# EAGLE design LSR_CNTRL (EAGLE 7.7.0)

## Sheet 1 of 3
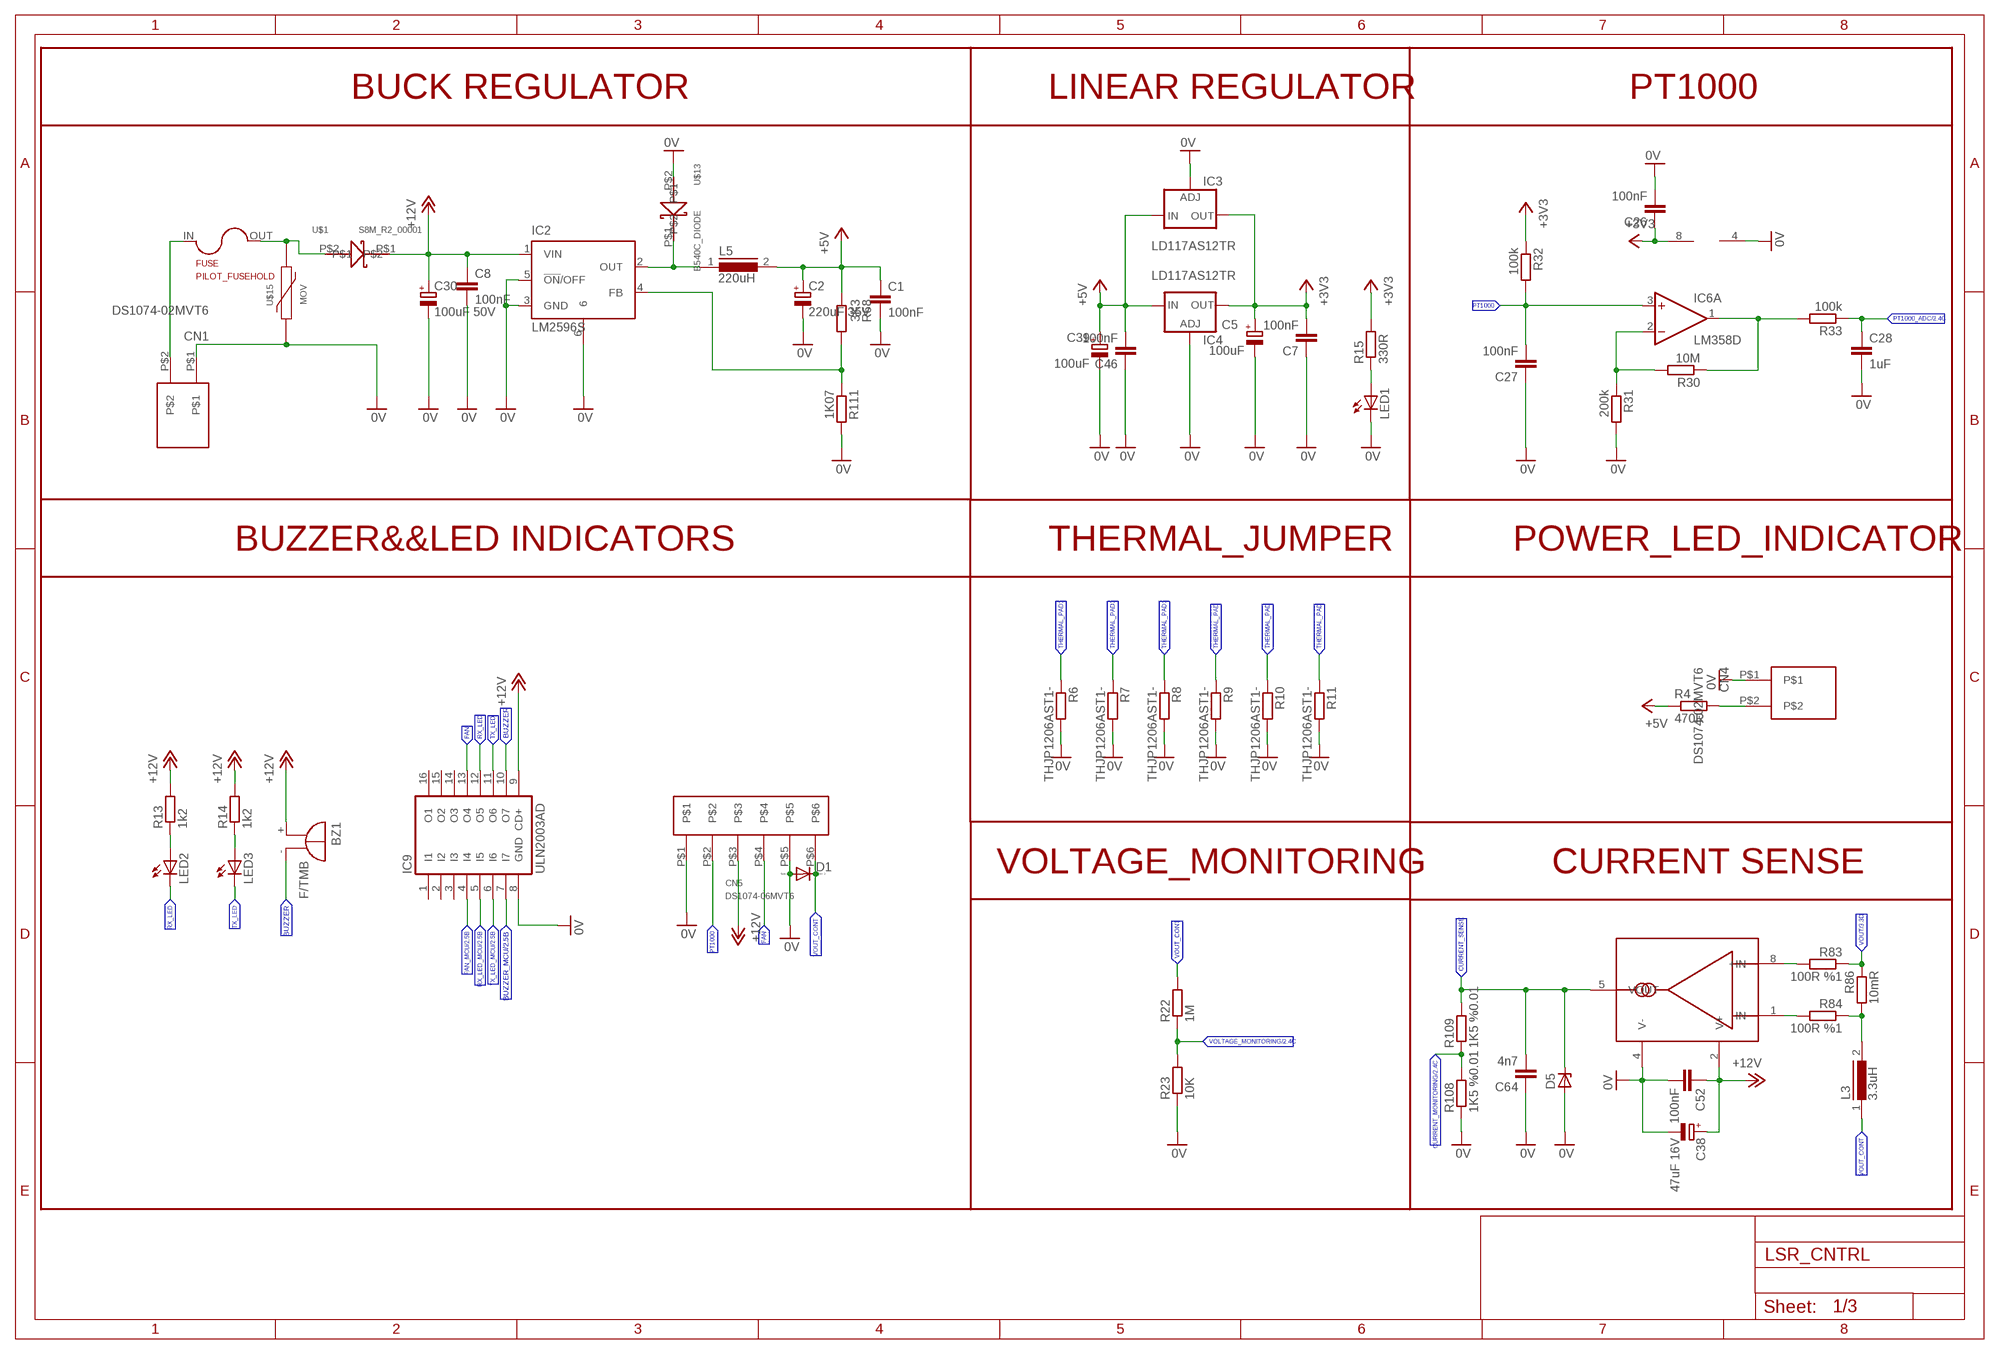
[diagram p0: schematic, sheet 1]

### Parts
BZ1  F/TMB  [F/TMB]
C1  100nF  C-EUC0805  [C0805]
C2  220uF 35V  CPOL-EU153CLV-0810  [153CLV-0810]
C5  100uF  CPOL-EU153CLV-0605  [153CLV-0605]
C7  100nF  C-EUC0603  [C0603]
C8  100nF  C-EUC0805  [C0805]
C26  100nF  C-EUC0603  [C0603]
C27  100nF  C-EUC0603  [C0603]
C28  1uF  C-EUC1206  [C1206]
C30  100uF 50V  CPOL-EU153CLV-0810  [153CLV-0810]
C38  47uF 16V  CPOL-EUB/3528-21R  [B/3528-21R]
C39  100uF  CPOL-EU153CLV-0605  [153CLV-0605]
C46  100nF  C-EUC0603  [C0603]
C52  100nF  C-EUC0805  [C0805]
C64  4n7  C-EUC0805  [C0805]
CN1  DS1074-02MVT6  [DS1074-02MVT6]
CN4  DS1074-02MVT6  [DS1074-02MVT6]
CN5  DS1074-06MVT6  [DS1074-06MVT6]
D1  DIODE-SMB  [SMB]
D5  ZENER-DIODESOD80C  [SOD80C]
FUSE  PILOT_FUSEHOLD  RTM_FUSEHOLD  [RTM_FUSEHOLD]
IC2  LM2596S  [TO263-5]
IC3  LD117AS12TR  [SOT223]
IC4  LD117AS12TR  [SOT223]
IC6  LM358D  [SO08]
IC9  ULN2003AD  [SO16]
L3  3.3uH  DR127  [DR127]
L5  220uH  DR125  [DR125]
LED1  LEDCHIPLED_0805  [CHIPLED_0805]
LED2  LEDCHIPLED_0805  [CHIPLED_0805]
LED3  LEDCHIPLED_0805  [CHIPLED_0805]
R4  470R  R-EU_M0805  [M0805]
R6  THJP1206AST1-  R-EU_M0805  [M0805]
R7  THJP1206AST1-  R-EU_M0805  [M0805]
R8  THJP1206AST1-  R-EU_M0805  [M0805]
R9  THJP1206AST1-  R-EU_M0805  [M0805]
R10  THJP1206AST1-  R-EU_M0805  [M0805]
R11  THJP1206AST1-  R-EU_M0805  [M0805]
R13  1k2  R-EU_R0603  [R0603]
R14  1k2  R-EU_R0603  [R0603]
R15  330R  R-EU_R0603  [R0603]
R22  1M  R-EU_R0603  [R0603]
R23  10K  R-EU_R0603  [R0603]
R30  10M  R-EU_R0603  [R0603]
R31  200k  R-EU_R0603  [R0603]
R32  100k  R-EU_R0603  [R0603]
R33  100k  R-EU_R0603  [R0603]
R68  3K3  R-EU_M0805  [M0805]
R83  100R %1  R-EU_R0805  [R0805]
R84  100R %1  R-EU_R0805  [R0805]
R86  10mR  R-EU_R2512  [R2512]
R108  1K5 %0.01  R-EU_R0603  [R0603]
R109  1K5 %0.01  R-EU_R0603  [R0603]
R111  1K07  R-EU_M0805  [M0805]
U$1  S8M_R2_00001  B540C_DIODE  [SMC]
U$5  LT6105  [MSOP-8]
U$13  B540C_DIODE  [SMC]
U$15  MOV-10D201K  [MOV-10D201K]

### Nets
0V: C1.2 C2.- C5.- C7.1 C8.2 C26.2 C27.1 C28.2 C30.- C38.- C39.- C46.1 C52.2 C64.1 CN1.P$1 CN4.P$1 CN5.P$1 CN5.P$5 D1.A D5.A IC2.3(GND) IC2.5(!ON!/OFF) IC2.6 IC3.1(ADJ) IC4.1(ADJ) IC6.4(P:V-) IC9.8(GND) LED1.C R6.2 R7.2 R8.2 R9.2 R10.2 R11.2 R23.1 R31.2 R108.1 R111.2 U$5.4(V-) U$13.P$2 U$15.1 ; also sheet 2,3
+3V3: C5.+ C7.2 C26.1 IC3.4(OUT) IC4.4(OUT) IC6.8(P:V+) R15.2 R32.1 ; also sheet 2,3
+5V: C1.1 C2.+ C39.+ C46.2 IC3.3(IN) IC4.3(IN) L5.2 R4.1 R68.1 ; also sheet 3
+12V: BZ1.+ C8.1 C30.+ C38.+ C52.1 CN5.P$3 IC2.1(VIN) IC9.9(CD+) R13.2 R14.2 U$1.P$1 U$5.2(V+) ; also sheet 3
BUZZER: BZ1.- IC9.10(O7)
BUZZER_MCU: IC9.7(I7) ; also sheet 2
CURRENT_MONITORING: R108.2 R109.1 ; also sheet 2
CURRENT_SENSE: C64.2 D5.C R109.2 U$5.5(VOUT)
FAN: CN5.P$4 IC9.13(O4)
FAN_MCU: IC9.4(I4) ; also sheet 2
N$1: CN1.P$2 FUSE.IN
N$3: LED2.A R13.1
N$5: LED3.A R14.1
N$8: FUSE.OUT U$1.P$2 U$15.2
N$11: CN4.P$2 R4.2
N$13: IC6.2(A:-IN) R30.2 R31.1
N$14: LED1.A R15.1
N$15: IC6.1(A:OUT) R30.1 R33.2
N$17: L3.2 R84.1 R86.2
N$87: R83.2 U$5.8(+IN)
N$88: R84.2 U$5.1(-IN)
N$216: IC2.2(OUT) L5.1 U$13.P$1
N$219: IC2.4(FB) R68.2 R111.1
PT1000: C27.2 CN5.P$2 IC6.3(A:+IN) R32.2
PT1000_ADC: C28.1 R33.1 ; also sheet 2
RX_LED: IC9.12(O5) LED2.C
RX_LED_MCU: IC9.5(I5) ; also sheet 2
THERMAL_PAD: R9.1 R10.1 R11.1
THERMAL_PAD1: R6.1 R7.1 R8.1
TX_LED: IC9.11(O6) LED3.C
TX_LED_MCU: IC9.6(I6) ; also sheet 2
VOLTAGE_MONITORING: R22.1 R23.2 ; also sheet 2
VOUT: R83.1 R86.1 ; also sheet 3
VOUT_CONT: CN5.P$6 D1.C L3.1 R22.2
Unconnected: IC6.5(B:+IN) IC6.6(B:-IN) IC6.7(B:OUT) IC9.1(I1) IC9.2(I2) IC9.3(I3) IC9.14(O3) IC9.15(O2) IC9.16(O1)

### Notes on the sheet
- BUCK REGULATOR | LINEAR REGULATOR | PT1000
- BUZZER&&LED INDICATORS | THERMAL_JUMPER | POWER_LED_INDICATOR
- VOLTAGE_MONITORING | CURRENT SENSE

## Sheet 2 of 3
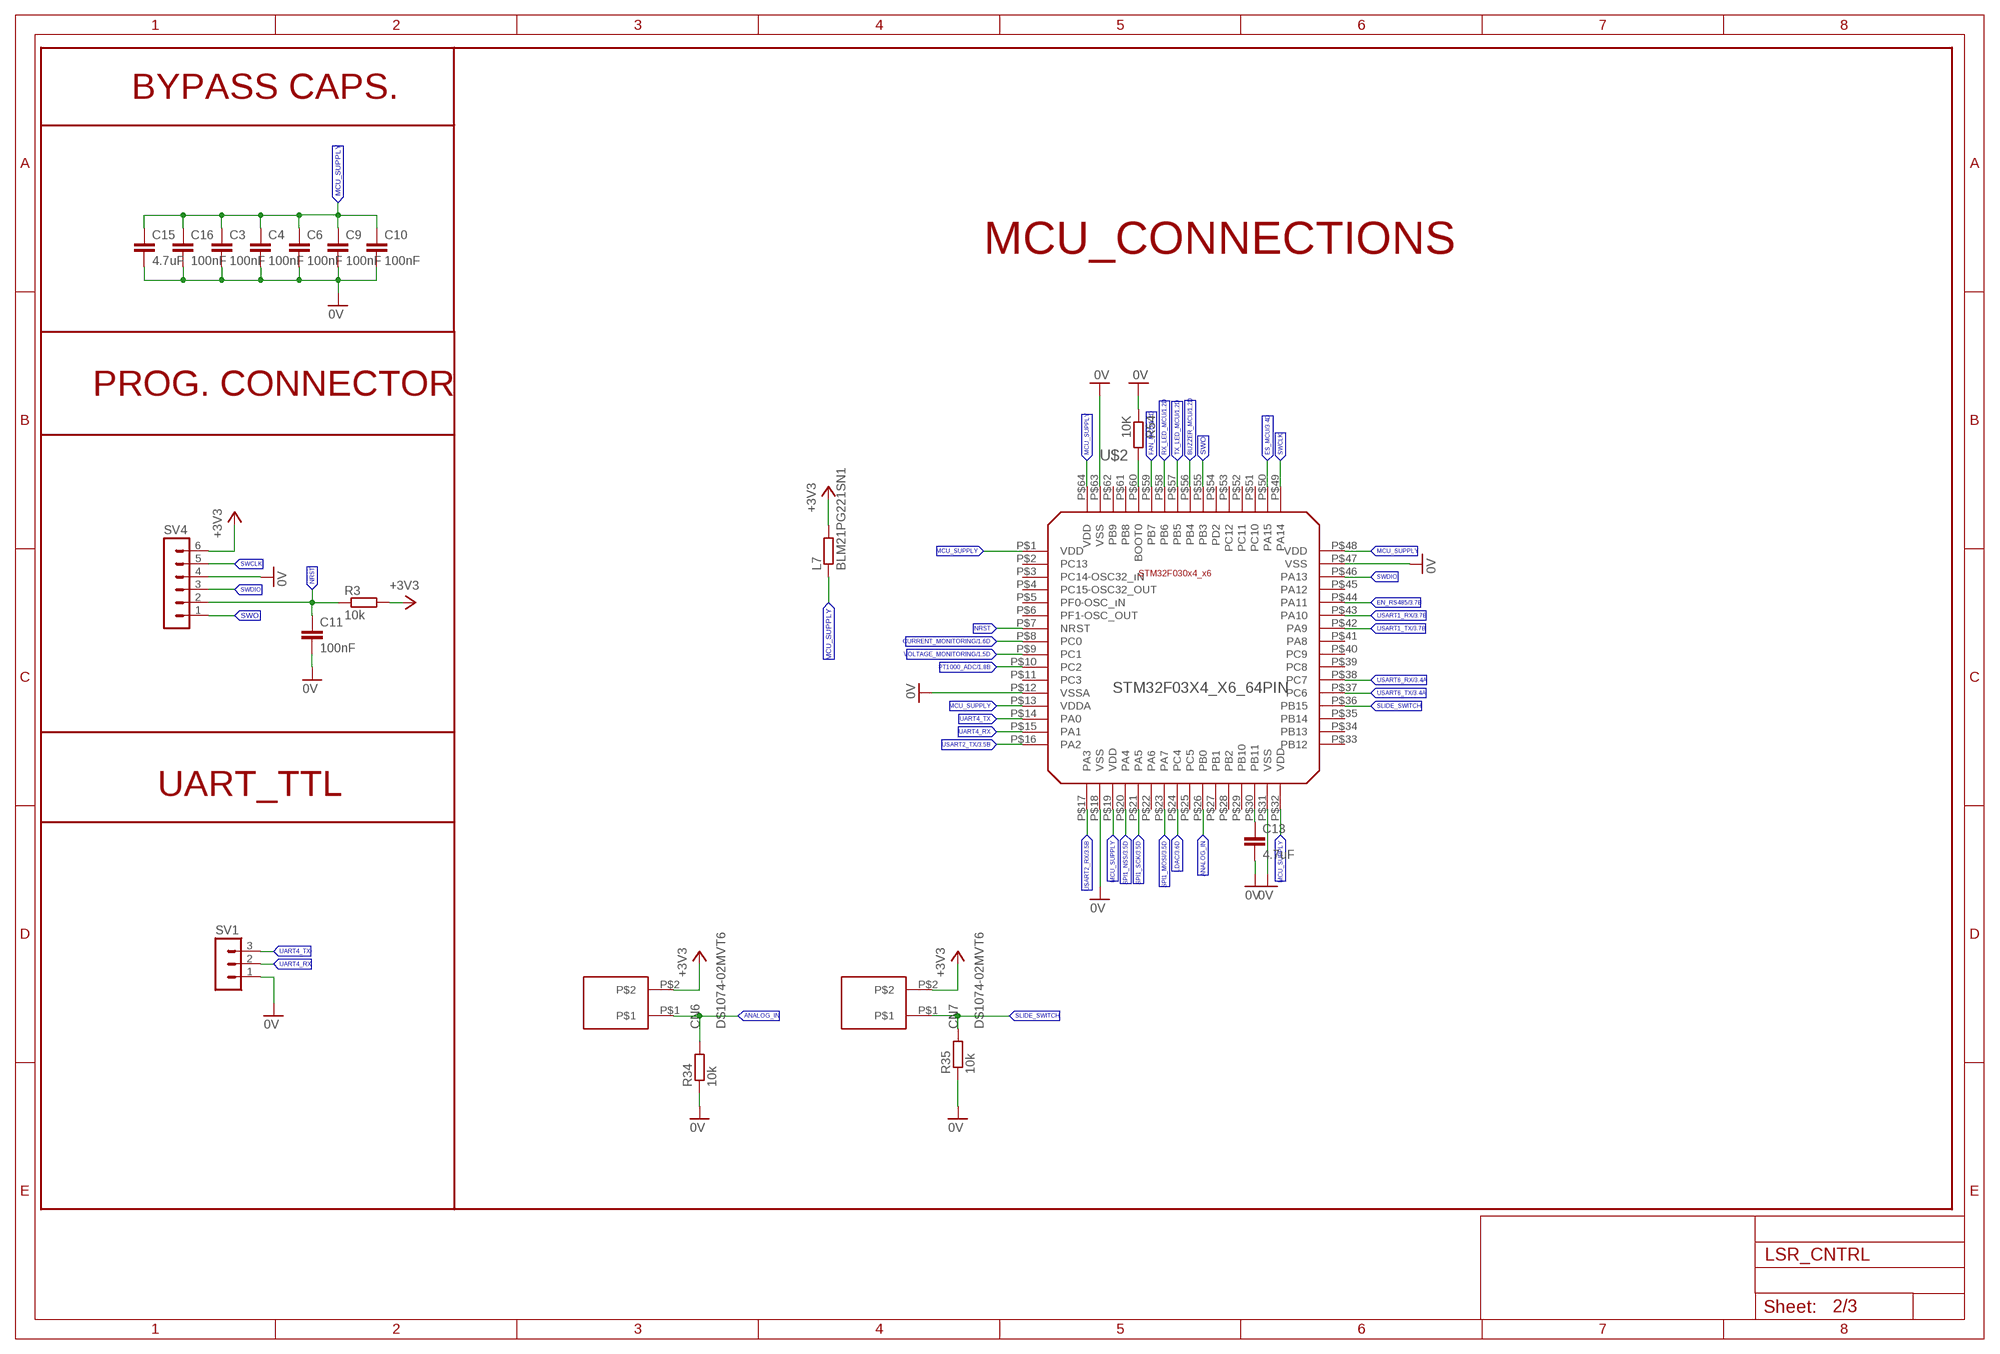
[diagram p1: schematic, sheet 2]

### Parts
C3  100nF  C-EUC0603  [C0603]
C4  100nF  C-EUC0603  [C0603]
C6  100nF  C-EUC0603  [C0603]
C9  100nF  C-EUC0603  [C0603]
C10  100nF  C-EUC0603  [C0603]
C11  100nF  C-EUC0603  [C0603]
C13  4.7uF  C-EUC0805  [C0805]
C15  4.7uF  C-EUC0805  [C0805]
C16  100nF  C-EUC0603  [C0603]
CN6  DS1074-02MVT6  [DS1074-02MVT6]
CN7  DS1074-02MVT6  [DS1074-02MVT6]
L7  BLM21PG221SN1  R-EU_R0805  [R0805]
R3  10k  R-EU_R0603  [R0603]
R34  10k  R-EU_R0603  [R0603]
R35  10k  R-EU_R0603  [R0603]
R54  10K  R-EU_R0603  [R0603]
SV1  MA03-1  [MA03-1]
SV4  MA06-1  [MA06-1]
U$2  STM32F03X4_X6_64PIN  [LQFP64]

### Nets
0V: C3.2 C4.2 C6.2 C9.2 C10.2 C11.2 C13.2 C15.2 C16.2 R34.1 R35.1 R54.1 SV1.1 SV4.4 U$2.P$12(VSSA) U$2.P$18(VSS) U$2.P$31(VSS) U$2.P$47(VSS) U$2.P$63(VSS) ; also sheet 1,3
+3V3: CN6.P$2 CN7.P$2 L7.2 R3.2 SV4.6 ; also sheet 1,3
ANALOG_IN: CN6.P$1 R34.2 U$2.P$26(PB0)
BUZZER_MCU: U$2.P$56(PB4) ; also sheet 1
CURRENT_MONITORING: U$2.P$8(PC0) ; also sheet 1
EN_RS485: U$2.P$44(PA11) ; also sheet 3
ES_MCU: U$2.P$50(PA15) ; also sheet 3
FAN_MCU: U$2.P$59(PB7) ; also sheet 1
LDAC: U$2.P$24(PC4) ; also sheet 3
MCU_SUPPLY: C3.1 C4.1 C6.1 C9.1 C10.1 C15.1 C16.1 L7.1 U$2.P$1(VDD) U$2.P$13(VDDA) U$2.P$19(VDD) U$2.P$32(VDD) U$2.P$48(VDD) U$2.P$64(VDD)
N$4: C13.1 U$2.P$30(PB11)
N$69: R54.2 U$2.P$60(BOOT0)
NRST: C11.1 R3.1 SV4.2 U$2.P$7(NRST)
PT1000_ADC: U$2.P$10(PC2) ; also sheet 1
RX_LED_MCU: U$2.P$58(PB6) ; also sheet 1
SLIDE_SWITCH: CN7.P$1 R35.2 U$2.P$36(PB15)
SPI1_MOSI: U$2.P$23(PA7) ; also sheet 3
SPI1_NSS: U$2.P$20(PA4) ; also sheet 3
SPI1_SCK: U$2.P$21(PA5) ; also sheet 3
SWCLK: SV4.5 U$2.P$49(PA14)
SWDIO: SV4.3 U$2.P$46(PA13)
SWO: SV4.1 U$2.P$55(PB3)
TX_LED_MCU: U$2.P$57(PB5) ; also sheet 1
UART4_RX: SV1.2 U$2.P$15(PA1)
UART4_TX: SV1.3 U$2.P$14(PA0)
USART1_RX: U$2.P$43(PA10) ; also sheet 3
USART1_TX: U$2.P$42(PA9) ; also sheet 3
USART2_RX: U$2.P$17(PA3) ; also sheet 3
USART2_TX: U$2.P$16(PA2) ; also sheet 3
USART6_RX: U$2.P$38(PC7) ; also sheet 3
USART6_TX: U$2.P$37(PC6) ; also sheet 3
VOLTAGE_MONITORING: U$2.P$9(PC1) ; also sheet 1
Unconnected: U$2.P$2(PC13) U$2.P$3(PC14-OSC32_ıN) U$2.P$4(PC15-OSC32_OUT) U$2.P$5(PF0-OSC_ıN) U$2.P$6(PF1-OSC_OUT) U$2.P$11(PC3) U$2.P$22(PA6) U$2.P$25(PC5) U$2.P$27(PB1) U$2.P$28(PB2) U$2.P$29(PB10) U$2.P$33(PB12) U$2.P$34(PB13) U$2.P$35(PB14) U$2.P$39(PC8) U$2.P$40(PC9) U$2.P$41(PA8) U$2.P$45(PA12) U$2.P$51(PC10) U$2.P$52(PC11) U$2.P$53(PC12) U$2.P$54(PD2) U$2.P$61(PB8) U$2.P$62(PB9)

### Notes on the sheet
- BYPASS CAPS.
- MCU_CONNECTIONS
- PROG. CONNECTOR
- UART_TTL

## Sheet 3 of 3
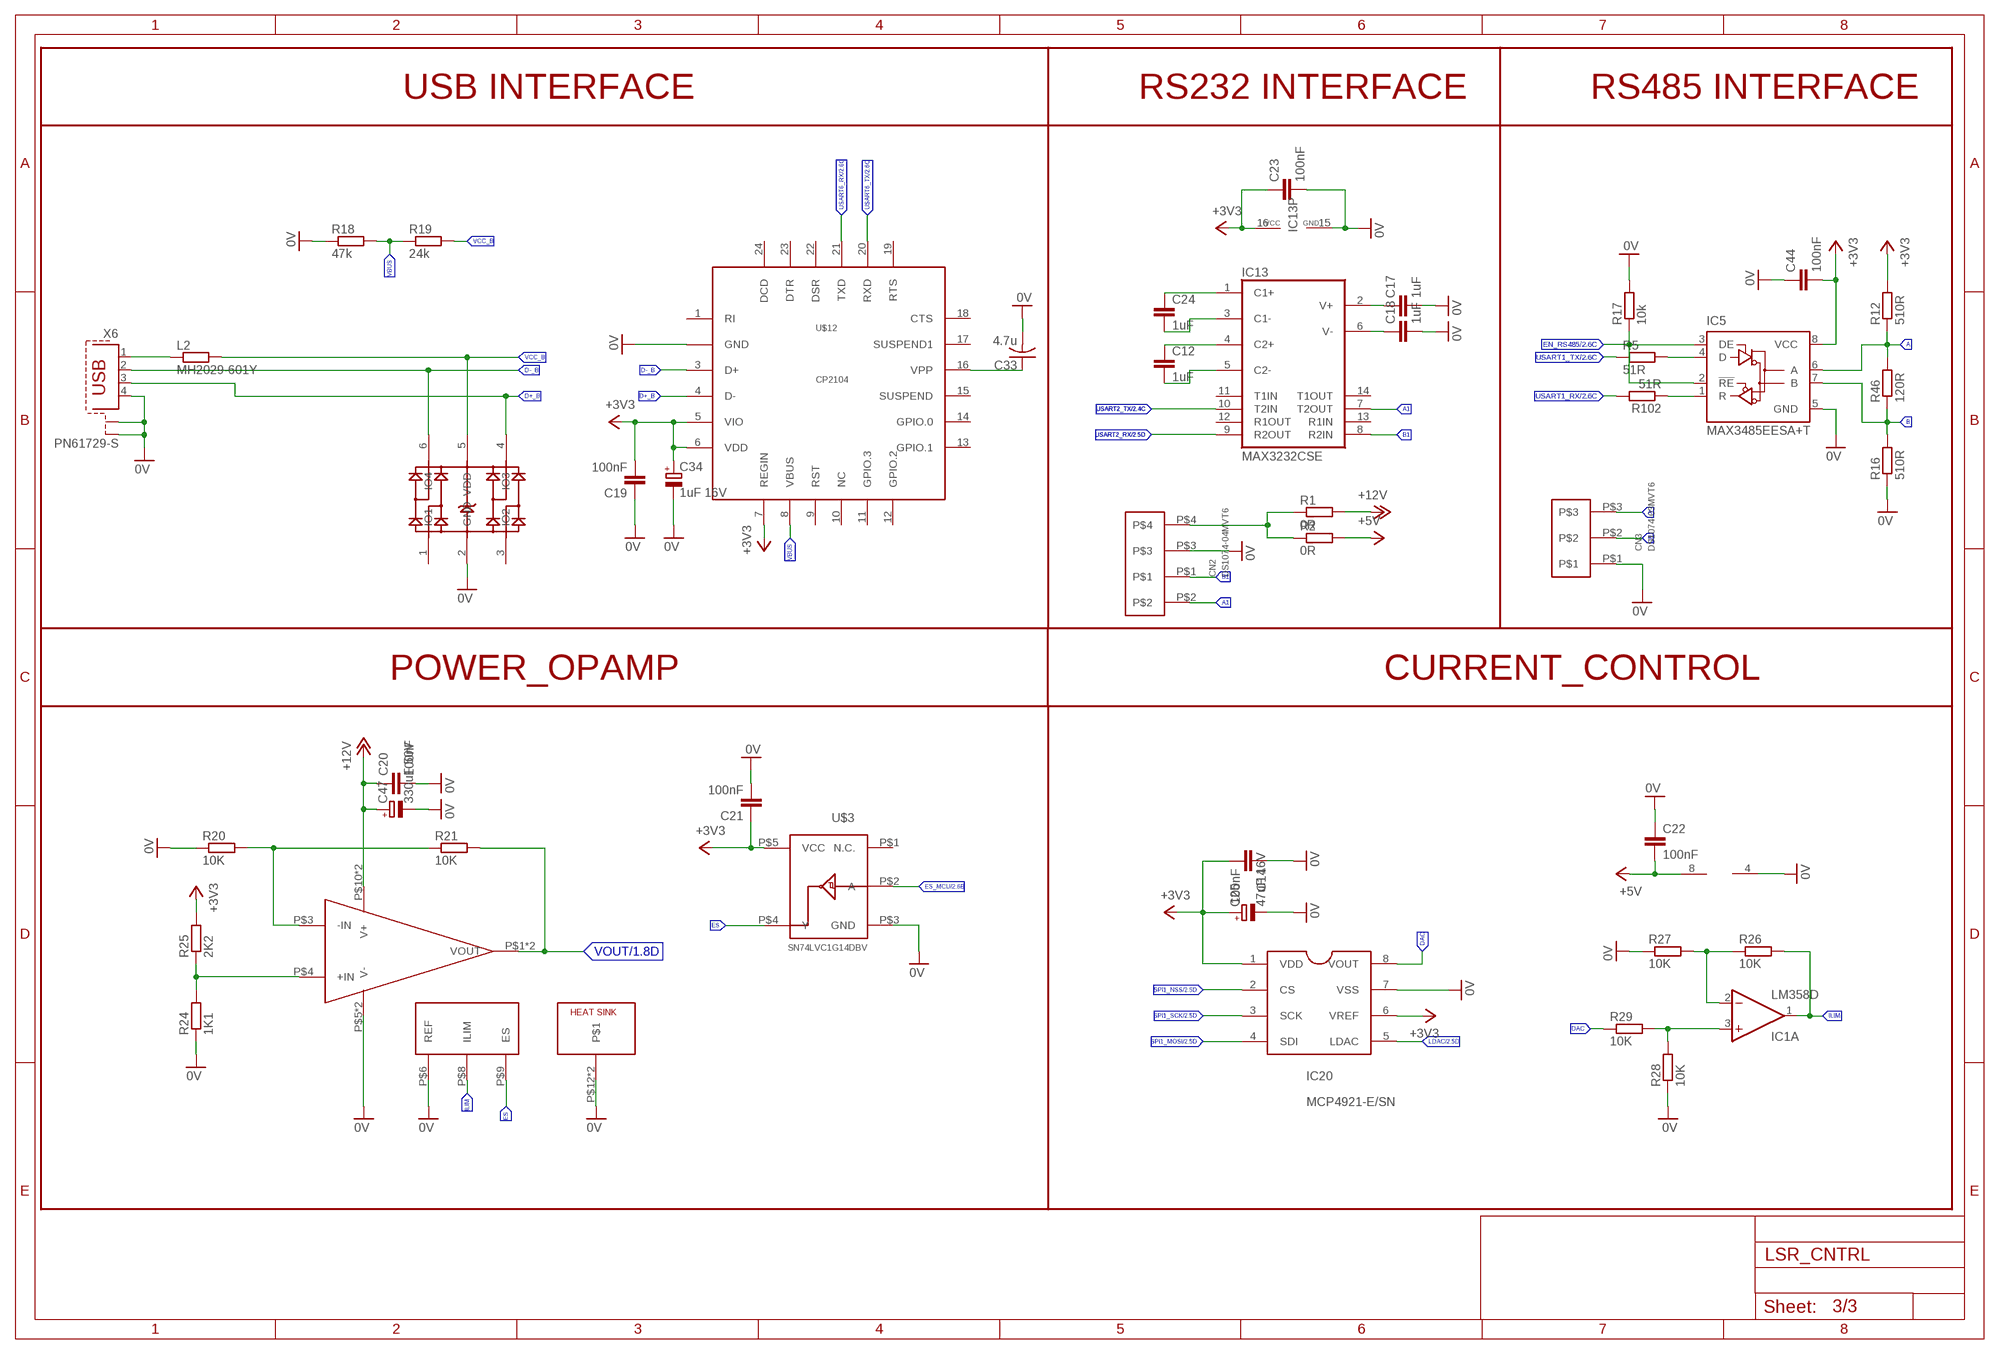
[diagram p2: schematic, sheet 3]

### Parts
C12  1uF  C-EUC1206  [C1206]
C14  100nF  C-EUC0603  [C0603]
C17  1uF  C-EUC1206  [C1206]
C18  1uF  C-EUC1206  [C1206]
C19  100nF  C-EUC0603  [C0603]
C20  100nF  C-EUC0603  [C0603]
C21  100nF  C-EUC0603  [C0603]
C22  100nF  C-EUC0603  [C0603]
C23  100nF  C-EUC0603  [C0603]
C24  1uF  C-EUC1206  [C1206]
C25  47uF 16V  CPOL-EUB/3528-21R  [B/3528-21R]
C33  4.7u  C-USC0805  [C0805]
C34  1uF 16V  CPOL-EUSMCZ  [SMC_Z]
C44  100nF  C-EUC0603  [C0603]
C47  330uF 50V  CPOL-EUE5-10.5  [E5-10,5]
CN2  DS1074-04MVT6  [DS1074-04MVT6]
CN3  DS1074-03MVT6  [DS1074-03MVT6]
IC1  LM358D  [SO08]
IC5  MAX3485EESA+T  75176AD  [D_R-PDSO-G8]
IC13  MAX3232CSE  [SO16]
IC20  MCP4921-E/SN  [SO-08-MCP]
L2  MH2029-601Y  R-EU_R0805  [R0805]
OPAMP1  OPA549MKVC  [OPA549MKVC]
R1  0R  R-EU_R0805  [R0805]
R2  0R  R-EU_R0805  [R0805]
R5  51R  R-EU_R0603  [R0603]
R12  510R  R-EU_R0603  [R0603]
R16  510R  R-EU_R0603  [R0603]
R17  10k  R-EU_R0603  [R0603]
R18  47k  R-EU_R0805  [R0805]
R19  24k  R-EU_R0805  [R0805]
R20  10K  R-EU_R0805  [R0805]
R21  10K  R-EU_R0805  [R0805]
R24  1K1  R-EU_R0805  [R0805]
R25  2K2  R-EU_R0805  [R0805]
R26  10K  R-EU_R0805  [R0805]
R27  10K  R-EU_R0805  [R0805]
R28  10K  R-EU_R0805  [R0805]
R29  10K  R-EU_R0805  [R0805]
R46  120R  R-EU_R0603  [R0603]
R102  51R  R-EU_R0603  [R0603]
TVS1  824001  [SOT23-6]
U$3  SN74LVC1G14DBV  [SOT-23-DBV]
U$12  CP2104  [CP2104]
X6  PN61729-S  [PN61729-S]

### Nets
0V: C14.1 C17.2 C18.2 C19.1 C20.2 C21.2 C22.1 C23.2 C25.- C33.2 C34.- C44.1 C47.- CN2.P$3 CN3.P$1 IC1.4(P:V-) IC5.5(GND) IC13.15(GND) IC20.7(VSS) OPAMP1.P$5(V-) OPAMP1.P$6(REF) OPAMP1.P$7(V-) OPAMP1.P$12 OPAMP1.P$13 R16.1 R17.2 R18.1 R20.1 R24.1 R27.1 R28.1 TVS1.2(GND) U$3.P$3(GND) U$12.2(GND) U$12.GND1(GND) X6.4 X6.S1 X6.S2 ; also sheet 1,2
+3V3: C14.2 C19.2 C21.1 C23.1 C25.+ C34.+ C44.2 IC5.8(VCC) IC13.16(VCC) IC20.1(VDD) IC20.6(VREF) R12.2 R25.2 U$3.P$5(VCC) U$12.5(VIO) U$12.6(VDD) U$12.7(REGIN) ; also sheet 1,2
+5V: C22.2 IC1.8(P:V+) R2.2 ; also sheet 1
+12V: C20.1 C47.+ OPAMP1.P$10(V+) OPAMP1.P$11(V+) R1.2 ; also sheet 1
A: CN3.P$3 IC5.6(A) R12.1 R46.2
A1: CN2.P$2 IC13.7(T2OUT)
B: CN3.P$2 IC5.7(B) R16.2 R46.1
B1: CN2.P$1 IC13.8(R2IN)
D+_B: TVS1.4(IO3) U$12.4(D-) X6.3
D-_B: TVS1.6(IO4) U$12.3(D+) X6.2
DAC: IC20.8(VOUT) R29.1
EN_RS485: IC5.2(!RE) IC5.3(DE) R17.1 ; also sheet 2
ES: OPAMP1.P$9(ES) U$3.P$4(Y)
ES_MCU: U$3.P$2(A) ; also sheet 2
ILIM: IC1.1(A:OUT) OPAMP1.P$8(ILIM) R26.2
LDAC: IC20.5(LDAC) ; also sheet 2
N$2: C18.1 IC13.6(V-)
N$6: OPAMP1.P$3(-IN) R20.2 R21.1
N$7: IC1.2(A:-IN) R26.1 R27.2
N$9: OPAMP1.P$4(+IN) R24.2 R25.1
N$10: IC1.3(A:+IN) R28.2 R29.2
N$12: IC5.4(D) R5.2
N$25: C33.1 U$12.16(VPP)
N$30: L2.1 X6.1
N$45: C24.1 IC13.1(C1+)
N$54: C24.2 IC13.3(C1-)
N$62: IC5.1(R) R102.1
N$65: C12.1 IC13.4(C2+)
N$66: C12.2 IC13.5(C2-)
N$67: C17.1 IC13.2(V+)
SPI1_MOSI: IC20.4(SDI) ; also sheet 2
SPI1_NSS: IC20.2(CS) ; also sheet 2
SPI1_SCK: IC20.3(SCK) ; also sheet 2
SUPPLY: CN2.P$4 R1.1 R2.1
USART1_RX: R102.2 ; also sheet 2
USART1_TX: R5.1 ; also sheet 2
USART2_RX: IC13.9(R2OUT) ; also sheet 2
USART2_TX: IC13.10(T2IN) ; also sheet 2
USART6_RX: U$12.21(TXD) ; also sheet 2
USART6_TX: U$12.20(RXD) ; also sheet 2
VBUS: R18.2 R19.1 U$12.8(VBUS)
VCC_B: L2.2 R19.2 TVS1.5(VDD)
VOUT: OPAMP1.P$1(VOUT) OPAMP1.P$2(VOUT) R21.2 ; also sheet 1
Unconnected: IC1.5(B:+IN) IC1.6(B:-IN) IC1.7(B:OUT) IC13.11(T1IN) IC13.12(R1OUT) IC13.13(R1IN) IC13.14(T1OUT) TVS1.1(IO1) TVS1.3(IO2) U$3.P$1(N.C.) U$12.1(RI) U$12.9(RST) U$12.10(NC) U$12.11(GPIO.3) U$12.12(GPIO.2) U$12.13(GPIO.1) U$12.14(GPIO.0) U$12.15(SUSPEND) U$12.17(SUSPEND1) U$12.18(CTS) U$12.19(RTS) U$12.22(DSR) U$12.23(DTR) U$12.24(DCD)

### Notes on the sheet
- USB INTERFACE | RS232 INTERFACE | RS485 INTERFACE
- POWER_OPAMP | CURRENT_CONTROL

## Library data of the parts
BZ1 = buzzer:F/TMB: BUZZER Source: Buerklin; OC_FARNELL: unknown; OC_NEWARK: unknown
C1 C3 C4 C6-C24 C26-C28 C44 C46 C52 C64 = rcl:C-EU: CAPACITOR, European symbol
C2 C5 C25 C30 C34 C38 C39 C47 = rcl:CPOL-EU: POLARIZED CAPACITOR, European symbol
C33 = rcl:C-US: CAPACITOR, American symbol
CN1 CN4 CN6 CN7 = Alihan_1:DS1074-02MVT6
CN2 = Alihan_1:DS1074-04MVT6
CN3 = Alihan_1:DS1074-03MVT6
CN5 = Alihan_1:DS1074-06MVT6
D1 = diode:DIODE-: DIODE
D5 = diode:ZENER-DIODE: Z-Diode
FUSE = RTM_FUSEHOLDER:RTM_FUSEHOLD
IC1 IC6 = linear:LM358: OP AMP also LM158; LM258; LM2904 Source: http://cache.national.com/ds/LM/LM158.pdf
IC2 = Aktif_Lib:LM2596: SIMPLE SWITCHER® Power Converter 150 kHz 3A Step-Down Voltage Regulator Source: http://www.national.com/ds/LM/LM2596.pdf; MF: NATIONAL SEMICONDUCTOR; MPN: LM2596S-ADJ/NOPB; OC_FARNELL: 9494367; OC_NEWARK: 41K3842
IC3 IC4 = v-reg:LD117A?*: Low drop fixed and adjustable positive voltage regulators 1 A Source: http://www.st.com/stonline/products/literature/ds/7194/ld1117axx.pdf
IC5 = 751xx:75176A: DIFFERENTIAL BUS TRANSCEIVER Source: http://focus.ti.com/lit/ds/symlink/sn75176a.pdf
IC9 = uln-udn:ULN2003A: DRIVER ARRAY
IC13 = maxim:MAX3232*: True RS-232 Transceivers 3.0V to 5.5V, Low-Power up to 1Mbps, Using Four 0.1µF External Capacitors Source: http://pdfserv.maxim-ic.com/en/ds/MAX3222-MAX3241.pdf; MPN: MAX3232CSE; OC_FARNELL: 9725490; OC_NEWARK: 90C2890
IC20 = Alihan_1_lib:MCP4921-E/SN
L2 L7 R1-R35 R46 R54 R68 R83 R84 R86 R102 R108 R109 R111 = rcl:R-EU_: RESISTOR, European symbol
L3 = inductors:DR127: High Power Density, High Efficiency, Shielded Inductors Source: coiltronics_dr_series.pdf
L5 = inductors:DR125: High Power Density, High Efficiency, Shielded Inductors Source: coiltronics_dr_series.pdf
LED1-LED3 = led:LED: LED OSRAM: - CHIPLED LG R971, LG N971, LY N971, LG Q971, LY Q971, LO R971, LY R971 LH N974, LH R974 LS Q976, LO Q976, LY Q976 LO Q996 - Hyper CHIPLED LW Q18S LB Q993, LB Q99A, LB R99A - SideLED LS A670, LO A670, LY A670, LG A670, LP A670 LB A673, LV A673, LT A673, LW A673 LH A674 LY A675 LS A676, LA A676, LO A676, LY A676, LW A676 LS A679, LY A679, LG A679 - Hyper Micro SIDELED® LS Y876, LA Y876, LO Y876, LY Y876 LT Y87S - SmartLED LW L88C, LW L88S LB L89C, LB L89S, LG L890 LS L89K, LO L89K, LY L89K LS L896, LA L896, LO L896, LY L896 - TOPLED LS T670, LO T670, LY T670, LG T670, LP T670 LSG T670, LSP T670, LSY T670, LOP T670, LYG T670 LG T671, LOG T671, LSG T671 LB T673, LV T673, LT T673, LW T673 LH T674 LS T676, LA T676, LO T676, LY T676, LB T676, LH T676, LSB T676, LW T676 LB T67C, LV T67C, LT T67C, LS T67K, LO T67K, LY T67K, LW E67C LS E67B, LA E67B, LO E67B, LY E67B, LB E67C, LV E67C, LT E67C LW T67C LS T679, LY T679, LG T679 LS T770, LO T770, LY T770, LG T770, LP T770 LB T773, LV T773, LT T773, LW T773 LH T774 LS E675, LA E675, LY E675, LS T675 LS T776, LA T776, LO T776, LY T776, LB T776 LHGB T686 LT T68C, LB T68C - Hyper Mini TOPLED® LB M676 - Mini TOPLED Santana® LG M470 LS M47K, LO M47K, LY M47K Source: http://www.osram.convergy.de LUXEON: - LUMILED® LXK2-PW12-R00, LXK2-PW12-S00, LXK2-PW14-U00, LXK2-PW14-V00 LXK2-PM12-R00, LXK2-PM12-S00, LXK2-PM14-U00 LXK2-PE12-Q00, LXK2-PE12-R00, LXK2-PE12-S00, LXK2-PE14-T00, LXK2-PE14-U00 LXK2-PB12-K00, LXK2-PB12-L00, LXK2-PB12-M00, LXK2-PB14-N00, LXK2-PB14-P00, LXK2-PB14-Q00 LXK2-PR12-L00, LXK2-PR12-M00, LXK2-PR14-Q00, LXK2-PR14-R00 LXK2-PD12-Q00, LXK2-PD12-R00, LXK2-PD12-S00 LXK2-PH12-R00, LXK2-PH12-S00 LXK2-PL12-P00, LXK2-PL12-Q00, LXK2-PL12-R00 Source: www.luxeon.com KINGBRIGHT: KA-3528ASYC Source: www.kingbright.com
OPAMP1 = Alihan_1:OPA549MKVC
SV1 = con-lstb:MA03-1: PIN HEADER; OC_FARNELL: unknown; OC_NEWARK: unknown
SV4 = con-lstb:MA06-1: PIN HEADER; OC_FARNELL: unknown; OC_NEWARK: unknown
TVS1 = Aktif_Lib:824001
U$1 U$13 = Alihan_1_lib:B540C_DIODE
U$2 = Alihan_1_lib:STM32F03X4_X6_64PIN
U$3 = Aktif_Lib:SN74LVC1G14DBV
U$5 = Aktif_Lib:LT6105
U$12 = Aktif_Lib:CP2104
U$15 = Aktif_Lib:MOV-10D201K
X6 = con-berg:PN61729-S: BERG USB connector; OC_FARNELL: unknown; OC_NEWARK: unknown

## Board
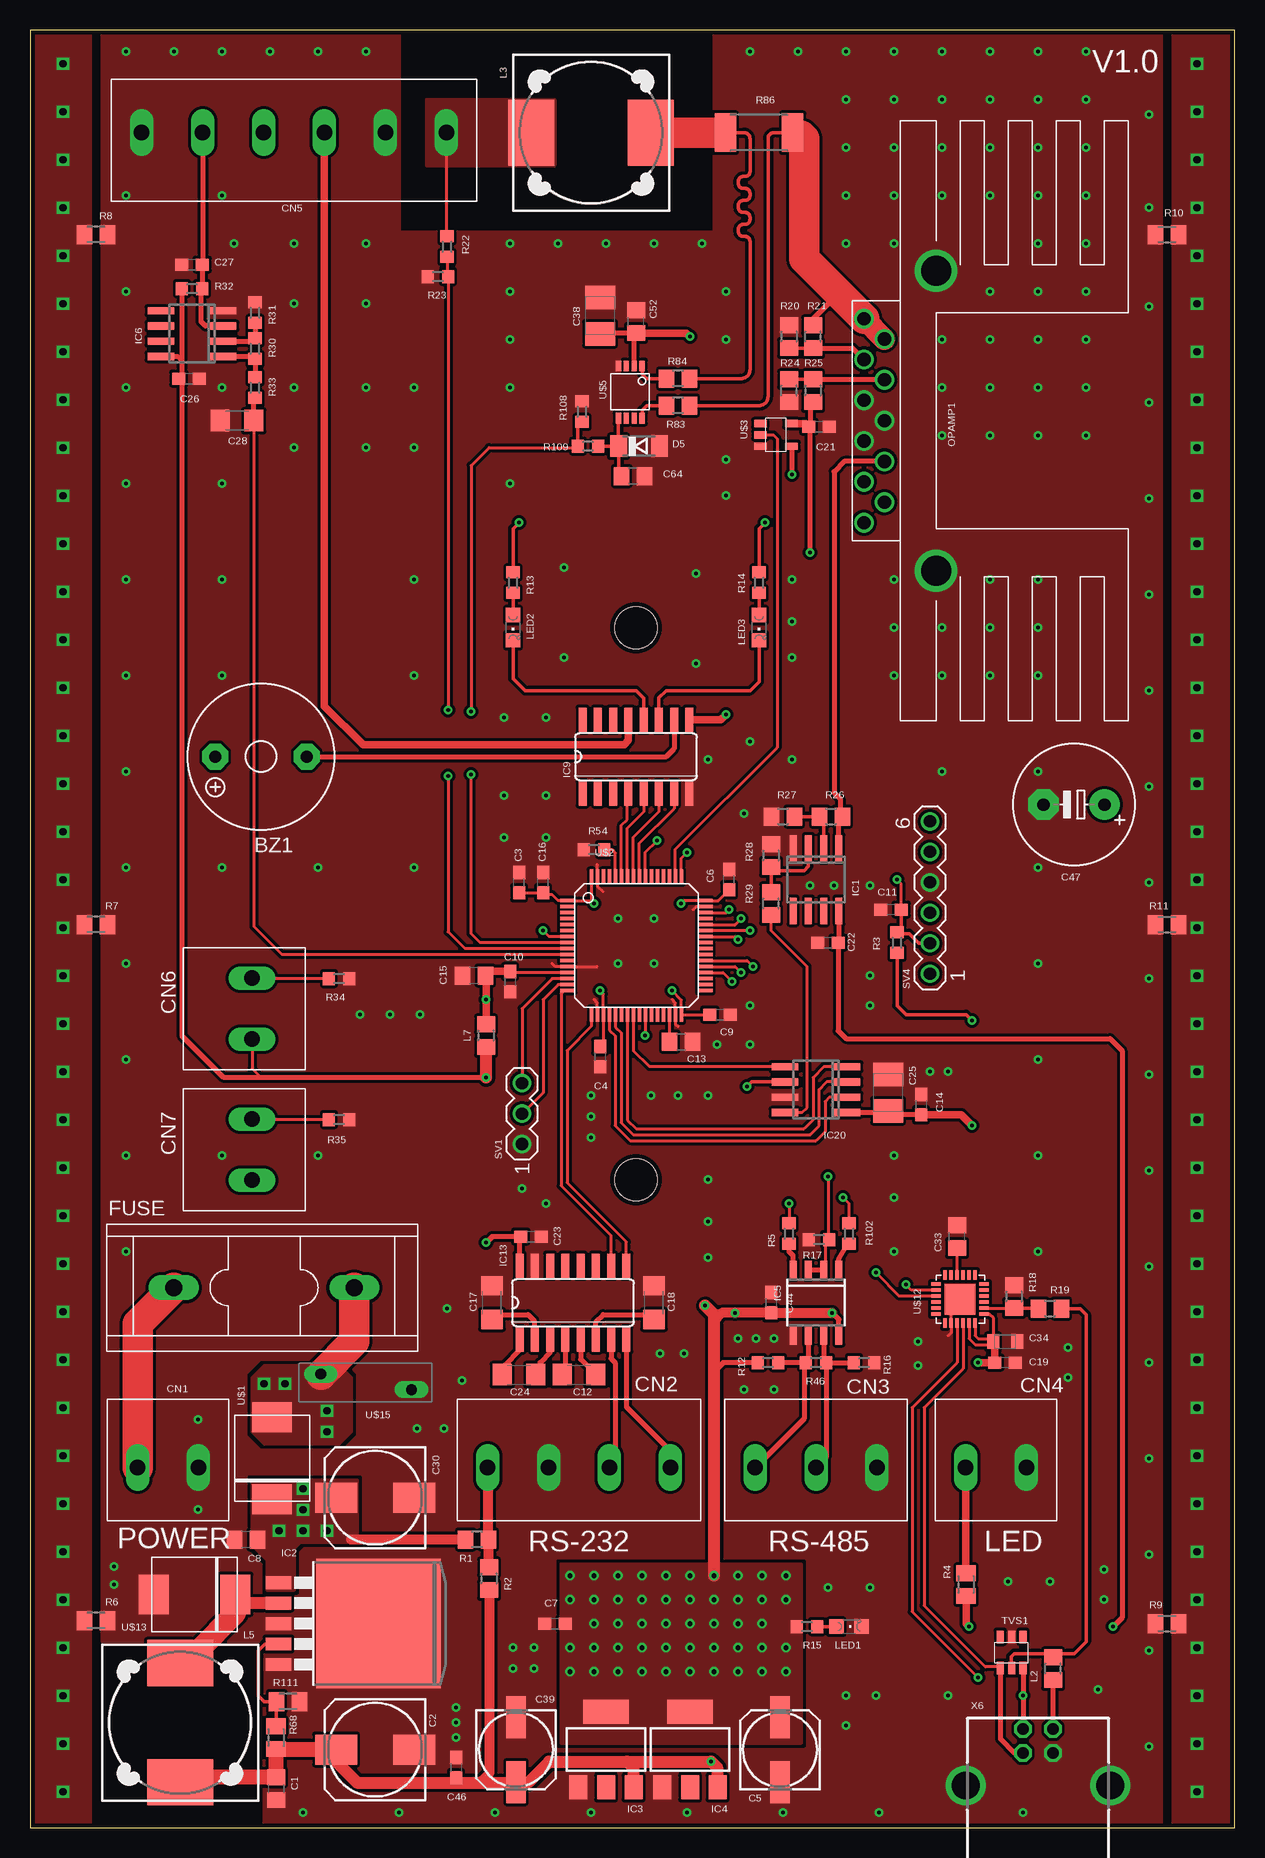
[diagram p3: board, top side]
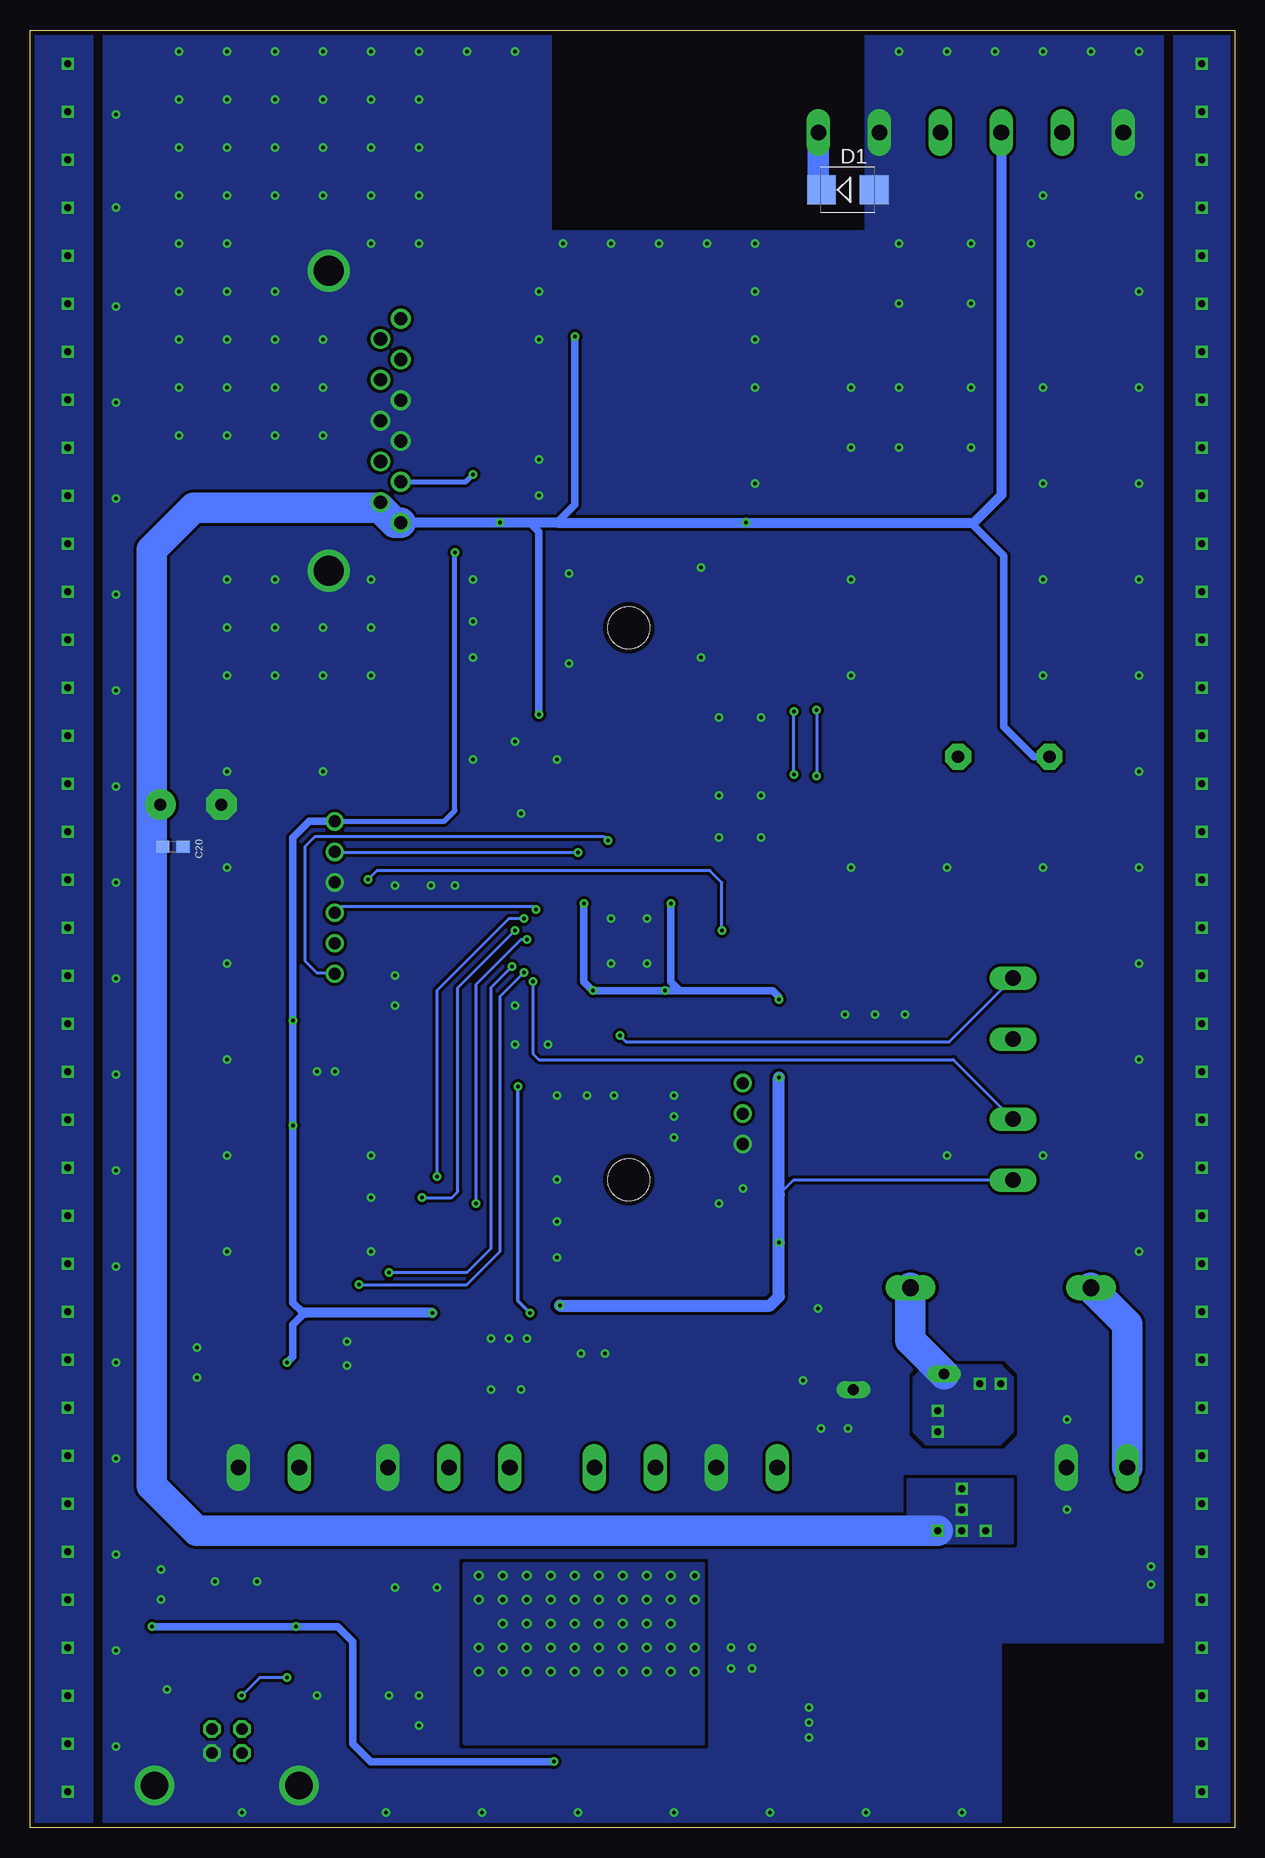
[diagram p4: board, bottom side, seen from below]

Size 100.4 x 149.8 mm. Coordinates in mm from the lower left corner, seen from the top.
Outline: 0,0 100.4,0 100.4,149.8 0,149.8 0,0
Copper layers (1*16): Top 0.035mm / dielectric 1.5mm / Bottom 0.035mm
Design rules "default *": minimum track width 10mil, minimum drill 24mil, track to track 8mil, track to pad 8mil, pad to pad 8mil, via to via 8mil, smd to smd 8mil, copper to edge 15mil, drill to drill 8mil, minimum pad ring 10mil, minimum via ring 8mil, stop-mask expansion 4mil, vias tented up to drill 0mil, thermal gap 10mil
Holes 3.5 mm at 50.5,54 50.5,100

### Footprints (pad centres in the part's own frame; a part is rotated, then mirrored left to right if it is on the bottom)
F/TMB = drill 1.016 pad 2.159 octagon: + 3.81,0; - -3.81,0
C0805 = smd 1.3 x 1.5: 1 -0.95,0; 2 0.95,0
153CLV-0810 = smd 3.5 x 2.5: + 3.25,0; - -3.25,0
C0603 = smd 1.1 x 1: 1 -0.85,0; 2 0.85,0
153CLV-0605 = smd 3.5 x 1.6: + 2.7,0; - -2.7,0
C1206 = smd 1.6 x 1.8: 1 -1.4,0; 2 1.4,0
B/3528-21R = smd 1.95 x 2.5: + 1.525,0; - -1.525,0
SMC_Z = smd 1 x 1.2: + -1,0; - 1,0
E5-10,5 = drill 1.016 pad 2.54: + -2.54,0 | drill 1.016 pad 2.54 octagon: - 2.54,0
DS1074-02MVT6 = drill 1.3 long: P$1 -2.54,0; P$2 2.54,0
DS1074-04MVT6 = drill 1.3 long: P$1 -7.62,0; P$2 -2.54,0; P$3 2.54,0; P$4 7.62,0
DS1074-03MVT6 = drill 1.3 long: P$1 -5.08,0; P$2 0,0; P$3 5.08,0
DS1074-06MVT6 = drill 1.3 long: P$1 -12.7,0; P$2 -7.62,0; P$3 -2.54,0; P$4 2.54,0; P$5 7.62,0; P$6 12.7,0
SMB = smd 2.4 x 2.4: A 2.2,0; C -2.2,0
SOD80C = smd 1.4 x 1.8: A 1.7,0; C -1.7,0
RTM_FUSEHOLD = drill 1.4 long: IN -7.52,0; OUT 7.53,0
SO08 = smd 0.6 x 2.2: 1 -1.905,-2.6; 2 -0.635,-2.6; 3 0.635,-2.6; 4 1.905,-2.6; 5 1.905,2.6; 6 0.635,2.6; 7 -0.635,2.6; 8 -1.905,2.6
TO263-5 = smd 1.067 x 2.159: 1 -3.404,-5.791; 2 -1.702,-5.791; 3 0,-5.791; 4 1.702,-5.791; 5 3.404,-5.791 | smd 10.8 x 10.41: 6 0,2.54
SOT223 = smd 1.5 x 2: 1 -2.3,-3.15; 2 0,-3.15; 3 2.3,-3.15 | smd 3.8 x 2: 4 0,3.15
D_R-PDSO-G8 = smd 0.6 x 1.5: 1 -1.905,-2.75; 2 -0.635,-2.75; 3 0.635,-2.75; 4 1.905,-2.75; 5 1.905,2.75; 6 0.635,2.75; 7 -0.635,2.75; 8 -1.905,2.75
SO16 = smd 0.66 x 2.032: 1 -4.445,-3.073; 2 -3.175,-3.073; 3 -1.905,-3.073; 4 -0.635,-3.073; 5 0.635,-3.073; 6 1.905,-3.073; 7 3.175,-3.073; 8 4.445,-3.073; 9 4.445,3.073; 10 3.175,3.073; 11 1.905,3.073; 12 0.635,3.073; 13 -0.635,3.073; 14 -1.905,3.073; 15 -3.175,3.073; 16 -4.445,3.073
SO-08-MCP = smd 0.6 x 2.2: 1 -1.905,-2.6; 2 -0.635,-2.6; 3 0.635,-2.6; 4 1.905,-2.6; 5 1.905,2.6; 6 0.635,2.6; 7 -0.635,2.6; 8 -1.905,2.6
R0805 = smd 1.3 x 1.5: 1 -0.95,0; 2 0.95,0
DR127 = smd 3.85 x 5.5: 1 -4.975,0; 2 4.975,0
DR125 = smd 3.85 x 5.5: 1 -4.975,0; 2 4.975,0
CHIPLED_0805 = smd 1.2 x 1.2: A 0,-1.05; C 0,1.05
OPA549MKVC = drill 1.1: P$1 -8.5,-3; P$2 -6.8,-1.3; P$3 -5.1,-3; P$4 -3.4,-1.3; P$5 -1.7,-3; P$6 0,-1.3; P$7 1.7,-3; P$8 3.4,-1.3; P$9 5.1,-3; P$10 6.8,-1.3; P$11 8.5,-3 | drill 2.5: P$12 -12.5,3; P$13 12.5,3
R0603 = smd 1 x 1.1: 1 -0.85,0; 2 0.85,0
M0805 = smd 1.3 x 1.6: 1 -0.95,0; 2 0.95,0
R2512 = smd 1.8 x 3.2: 1 -2.8,0; 2 2.8,0
MA03-1 = drill 1.016: 1 -2.54,0; 2 0,0; 3 2.54,0
MA06-1 = drill 1.016: 1 -6.35,0; 2 -3.81,0; 3 -1.27,0; 4 1.27,0; 5 3.81,0; 6 6.35,0
SOT23-6 = smd 1.05 x 0.6: 1 -1.389,1.006; 2 -1.389,0.056; 3 -1.389,-0.894; 4 1.211,-0.894; 5 1.211,0.056; 6 1.211,1.006
SMC = smd 2.5 x 3.3: P$1 -3.62,-0.18; P$2 3.18,-0.18
LQFP64 = smd 1.2 x 0.3: P$1 -5.715,3.75; P$2 -5.715,3.25; P$3 -5.715,2.75; P$4 -5.715,2.25; P$5 -5.715,1.75; P$6 -5.715,1.25; P$7 -5.715,0.75; P$8 -5.715,0.25; P$9 -5.715,-0.25; P$10 -5.715,-0.75; P$11 -5.715,-1.25; P$12 -5.715,-1.75; P$13 -5.715,-2.25; P$14 -5.715,-2.75; P$15 -5.715,-3.25; P$16 -5.715,-3.75; P$33 5.785,-3.75; P$34 5.785,-3.25; P$35 5.785,-2.75; P$36 5.785,-2.25; P$37 5.785,-1.75; P$38 5.785,-1.25; P$39 5.785,-0.75; P$40 5.785,-0.25; P$41 5.785,0.25; P$42 5.785,0.75; P$43 5.785,1.25; P$44 5.785,1.75; P$45 5.785,2.25; P$46 5.785,2.75; P$47 5.785,3.25; P$48 5.785,3.75 | smd 0.3 x 1.2: P$17 -3.715,-5.75; P$18 -3.215,-5.75; P$19 -2.715,-5.75; P$20 -2.215,-5.75; P$21 -1.715,-5.75; P$22 -1.215,-5.75; P$23 -0.715,-5.75; P$24 -0.215,-5.75; P$25 0.285,-5.75; P$26 0.785,-5.75; P$27 1.285,-5.75; P$28 1.785,-5.75; P$29 2.285,-5.75; P$30 2.785,-5.75; P$31 3.285,-5.75; P$32 3.785,-5.75; P$49 3.785,5.75; P$50 3.285,5.75; P$51 2.785,5.75; P$52 2.285,5.75; P$53 1.785,5.75; P$54 1.285,5.75; P$55 0.785,5.75; P$56 0.285,5.75; P$57 -0.215,5.75; P$58 -0.715,5.75; P$59 -1.215,5.75; P$60 -1.715,5.75; P$61 -2.215,5.75; P$62 -2.715,5.75; P$63 -3.215,5.75; P$64 -3.715,5.75
SOT-23-DBV = smd 1.05 x 0.6: P$1 -1.389,1.006; P$2 -1.389,0.056; P$3 -1.389,-0.894; P$4 1.211,-0.894; P$5 1.211,1.006
MSOP-8 = smd 0.45 x 0.9: 1 1.01,2.05; 2 0.35,2.05; 3 -0.31,2.05; 4 -0.97,2.05; 5 -0.97,-2.3; 6 -0.31,-2.3; 7 0.35,-2.3; 8 1.01,-2.3
CP2104 = smd 0.8 x 0.3: 1 -1.95,1.25; 2 -1.95,0.75; 3 -1.95,0.25; 4 -1.95,-0.25; 5 -1.95,-0.75; 6 -1.95,-1.25; 13 2.05,-1.25; 14 2.05,-0.75; 15 2.05,-0.25; 16 2.05,0.25; 17 2.05,0.75; 18 2.05,1.25 | smd 0.3 x 0.8: 7 -1.2,-2; 8 -0.7,-2; 9 -0.2,-2; 10 0.3,-2; 11 0.8,-2; 12 1.3,-2; 19 1.3,2; 20 0.8,2; 21 0.3,2; 22 -0.2,2; 23 -0.7,2; 24 -1.2,2 | smd 2.54 x 2.54: GND1 0,0
MOV-10D201K = drill 0.9 long: 1 -3.79,0; 2 3.77,-1.3
PN61729-S = drill 0.95 octagon: 1 1.25,4.71; 2 -1.25,4.71; 3 -1.25,2.71; 4 1.25,2.71 | drill 2.3 pad 2.9: S1 -6.02,0; S2 6.02,0

### Placement (x,y rotation side)
BZ1  19.25,89.25 180 top
C1  20.5,3.25 270 top
C2  28.75,6.5 180 top
C3  40.75,78.75 90 top
C4  47.5,64.25 270 top
C5  62.5,6.5 90 top
C6  58.25,79 90 top
C7  43.75,17 0 top
C8  18,24 180 top
C9  57.5,67.75 0 top
C10  40,70.5 270 top
C11  71.75,76.5 180 top
C12  45.75,37.75 0 top
C13  54.25,65.5 0 top
C14  74.25,60.25 270 top
C15  37,71 180 top
C16  42.75,78.75 90 top
C17  38.5,43.75 90 top
C18  52,43.75 90 top
C19  81.25,38.75 180 top
C20  88.5,81.75 0 bottom
C21  65.75,116.75 0 top
C22  66.5,73.75 0 top
C23  41.75,49.25 0 top
C24  40.75,37.75 0 top
C25  71.5,61.25 270 top
C26  13.25,120.75 0 top
C27  13.5,130.25 0 top
C28  17.25,117.25 180 top
C30  28.75,27.5 180 top
C33  77.25,49.25 90 top
C34  81.25,40.5 0 top
C38  47.5,126 270 top
C39  40.5,6.5 270 top
C44  61.75,43.75 270 top
C46  35.5,5 270 top
C47  87,85.25 180 top
C52  50.5,125.5 90 top
C64  50.25,112.62 180 top
CN1  11.5,30 180 top
CN2  45.75,30 180 top
CN3  65.5,30 180 top
CN4  80.5,30 180 top
CN5  22,141.25 0 top
CN6  18.5,68.25 270 top
CN7  18.5,56.5 270 top
D1  32.25,136.5 0 bottom
D5  50.75,115.12 0 top
FUSE  19.5,45 0 top
IC1  65.5,79 180 top
IC2  26.5,17 270 top
IC3  48,6.5 0 top
IC4  55,6.5 0 top
IC5  65.5,43.75 180 top
IC6  13.5,124.5 90 top
IC9  50.5,89.25 0 top
IC13  45.25,43.75 0 top
IC20  65.5,61.5 90 top
L2  85.25,13.25 90 top
L3  46.75,141.25 0 top
L5  12.5,8.75 270 top
L7  38,66 270 top
LED1  68.25,16.75 270 top
LED2  40.25,100 180 top
LED3  60.75,100 180 top
OPAMP1  72.5,117.25 270 top
R1  37.25,24 180 top
R2  38.25,20.75 270 top
R3  72.25,73.75 270 top
R4  78,20.25 90 top
R5  63.25,49.5 270 top
R6  5.5,17.25 0 top
R7  5.5,75.25 0 top
R8  5.5,132.75 0 top
R9  94.75,17 180 top
R10  94.75,132.75 180 top
R11  94.75,75.25 180 top
R12  61.5,38.75 180 top
R13  40.25,103.75 90 top
R14  60.75,103.75 90 top
R15  64.75,16.75 180 top
R16  69.5,38.75 180 top
R17  65.75,49 180 top
R18  82,44.25 270 top
R19  85,43.25 0 top
R20  63.25,124.25 270 top
R21  65.25,124.25 90 top
R22  34.75,131.75 90 top
R23  34,129.25 0 top
R24  63.25,119.75 90 top
R25  65.25,119.75 270 top
R26  66.75,84.25 0 top
R27  62.75,84.25 0 top
R28  61.75,81 270 top
R29  61.75,77 90 top
R30  18.75,123.25 90 top
R31  18.75,126.25 90 top
R32  13.5,128.25 0 top
R33  18.75,120 90 top
R34  25.75,70.75 180 top
R35  25.75,59 180 top
R46  65.5,38.75 180 top
R54  47,81.5 0 top
R68  20.5,7.5 90 top
R83  54,118.5 180 top
R84  54,120.75 180 top
R86  60.75,141.25 180 top
R102  68.25,49.5 90 top
R108  46,118 270 top
R109  46.5,115.12 0 top
R111  21.5,10.5 0 top
SV1  41,59.5 90 top
SV4  75,77.5 90 top
TVS1  81.75,14.5 270 top
U$1  20,31 90 top
U$2  50.5,73.5 0 top
U$3  62.25,116 0 top
U$5  50,119.75 0 top
U$12  77.5,44 90 top
U$13  13.5,19.25 180 top
U$15  28,36.5 180 top
X6  84,3.5 0 top

### Tracks (layer width: path | path; a pad name or v marks a point on that pad's centre or on a via)
0V  (via drill 0.3)
  Top 0.254: 47.25,71.75 U$2.P$12 43.75,71.75 43.5,72 | U$2.P$18 47.28,68.72 47,69 | 54,66.75 53.78,66.97 U$2.P$31 53.78,68.72 53.5,69 | U$2.P$47 55.5,76.75 55.25,76.5 | 47.75,78 47.28,78.47 U$2.P$63 47.28,80.22 47.25,80.25 | 76.75,43 U$12.2 76.75,41.25 76.5,41
  other vias: 57.25,65.25 60,68.5 49,75.75 52,75.75 52,72 49,72 46.75,61 46.75,59.25 46.75,57.5 51.75,61 54,61 56.5,61 32.5,67.75 30,67.75 27.5,67.75 59,40.75 60.5,40.75 62,40.75 40.25,13.25 42,13.25 42,15 40.25,15 35.5,7.5 35.5,8.75 35.5,10 8,128 8,136 8,120 8,112 8,104 8,96 8,88 8,80 8,72 8,64 8,56 8,48 16,56 16,80 16,96 16,104 16,112 16,136 24,56 32,80 24,80 32,96 32,104 32,115 32,120 40,120 40,128 40,112 93.25,62.75 93.25,54.75 93.25,46.75 93.25,38.75 93.25,30.75 93.25,22.75 93.25,14.75 93.25,6.75 93.25,70.75 93.25,78.75 93.25,86.75 93.25,94.75 93.25,102.75 93.25,110.75 93.25,118.75 93.25,126.75 93.25,135 93.25,142.75 76,124 76,120 80,120 80,124 84,124 88,124 88,120 84,120 84,116 88,116 80,116 76,116 80,104 84,104 84,100 80,100 76,100 76,96 80,96 84,96 80,128 84,128 88,128 88,132 84,132 84,136 88,136 88,140 88,144 84,144 84,140 80,140 80,136 76,136 76,140 76,144 80,144 72,144 68,144 68,140 72,140 72,136 68,136 68,132 72,132 76,88 84,64 84,56 84,72 84,80 84,88 84,48 72,48 72,56 17,132 16,120 22,115 22,120 22,127 22,132 28,132 28,127 28,120 28,115 58,111 58,114 58,124 58,128 63.5,104 63.5,100.5 63.5,97.5 63.5,89 59.5,84.5 56.5,89 60,90.5 55.5,97 55.5,104.5 44.5,105 44.5,97.5 39.5,92.5 43,92.5 39.5,86 43,86 43,82.5 39.5,82.5 65,78.5 67,78.5 70,78.5 70,68.5 70,71 76.5,63 75,63 56.5,54 56.5,50.5 56.5,47.5 52.5,39.5 54.5,39.5 59.5,36.5 62,36.5 74,38.5 74,40.5 86.5,37.5 86.5,40 89.5,19 89.5,21.5 81.5,20.5 85,20.5 89,11.5 76.5,11 68,8.5 68,11 70.5,11 66.5,20 70,20 22.75,1.25 30.75,1.25 38.75,1.25 46.75,1.25 54.75,1.25 62.75,1.25 70.75,1.25 82.75,1.25 7,20.25 7,21.75 14,26.5 14,34 34.5,33.25 32.25,33.25 36,37.25 34.75,43.25 41,53.25 43,52 72,52.5 72,100 72,96 72,104 40,132 44,132 48,132 52,132 56,132 40,124 8,148 12,148 16,148 20,148 24,148 28,148 60,148 64,148 68,148 72,148 76,148 80,148 84,148 88,148 60,65.25
  pour Top (isolate 0.254, rank 2, no thermals): 6,133.5 6,149.75 30.75,149.75 30.75,133.5 30.75,133 57,133 57,149.75 94,149.75 94.25,149.75 94.25,0 19.5,0 19.5,15.5 6,15.5 6,25.75
  pour Bottom (isolate 0.254, rank 2, no thermals): 19.5,0 19.5,15.5 6,15.5 6,149.75 30.75,149.75 30.75,133 57,133 57,149.75 94.25,149.75 94.25,0
+3V3  (via drill 0.3, 0.4)
  Top 0.254: U$12.5 78.25,40.75 78.75,40.25 80,40.25 C34.+ | U$12.6 78.75,41 79,40.75 80,40.75 C34.+ | U$12.7 79.95,42.8 80.25,42.5 C34.+ | CN6.P$2 18.5,63.25 19.25,62.5
  Top 0.305: IC20.6 60.13,62.13 v59.75,61.75 | R3.2 72.25,68.5 73,67.75 78,67.75 v78.5,67.25
  Top 0.406: IC13.16 40.8,49.16 C23.1 38.5,49.25 v38,48.75 | R32.1 12.65,122.25 | 12.65,122.25 12.65,121 | IC6.8 12.3,122.59 12.65,122.25 | 12.65,121 C26.1 | R12.2 57.75,38.75 57,38 | v66.85,42.9 67.41,42.34 IC5.8 | IC20.1 71.37,59.59 C25.+ 71.83,59.4 C14.2 | 12.65,121 12.65,66 16.15,62.5 19.25,62.5 v38,62.5 | v65,106.25 65,116.65 C21.1 65,116.85 65,118.75 65.05,118.8 R25.2
  Top 0.61: C34.+ 80.4,40.35 C19.2 v79,38.75 | U$3.P$5 64.64,117.01 C21.1 | C14.2 77.6,59.4 v78.5,58.5
  Top 0.813: 57,42.25 57.65,42.9 v58.75,42.9 C44.2 v66.85,42.9
  Top 1.016: v57,21 57,38 57,42.25 57,42.75 v56.25,43.5 | v38,62.5 L7.2
  Bottom 0.254: CN7.P$2 36.79,53.96 38,52.75
  Bottom 0.305: v59.75,61.75 59.75,43.9 v58.75,42.9
  Bottom 0.406: SV4.6 65.9,83.85 65,84.75 v65,106.25
  Bottom 0.61: SV4.6 77.15,83.85 78.5,82.5 v78.5,67.25 v78.5,58.5 78.5,43.75 77.65,42.9 | v79,38.75 78.5,39.25 78.5,41.9 77.5,42.9
  Bottom 0.813: v66.85,42.9 77.5,42.9 77.65,42.9
  Bottom 1.016: v56.25,43.5 38.75,43.5 38,44.25 v38,48.75 38,52.75 v38,62.5
  other vias: 45,21 47,21 49,21 51,21 53,21 55,21 59,21 61,21 63,21 63,19 61,19 59,19 57,19 55,19 53,19 51,19 49,19 47,19 45,19 47,17 49,17 51,17 53,17 55,17 57,17 59,17 61,17 63,15 61,15 59,15 57,15 55,15 53,15 51,15 49,15 47,15 45,15 45,13 47,13 49,13 51,13 53,13 55,13 57,13 59,13 61,13 63,13
  pour Top (no thermals): 44.25,7.75 44.25,22 64.25,22 64.25,7 44.25,7
  pour Bottom: 44.25,22 64.25,22 64.25,7 44.25,7 44.25,21.75
+5V  (via drill 0.3)
  Top 0.406: IC1.8 67.41,73.81 C22.2 67.35,66.4 68,65.75 90,65.75 91,64.75 91,17.5 v90.25,16.75
  Top 0.61: R4.1 78,17 v78.25,16.75
  Top 0.813: R2.2 38.25,4.5 37.5,3.75
  Top 1.016: C2.+ 25.5,5.5 27.25,3.75 35.75,3.75 | 35.75,3.75 37.5,3.75 40.45,3.75 C39.+ 41.55,3.8 43.25,5.5 49.75,5.5 | C46.2 35.5,4 35.75,3.75 | 49.75,5.5 v56.75,5.5 57.25,5 57.25,3.4 IC4.3 | IC3.3 50.3,4.95 49.75,5.5
  Top 1.27: L5.2 12.03,4.25 11.5,4.25 11.55,4.2 C1.1 R68.1 25.45,6.55 C2.+
  Bottom 0.61: v56.75,5.5 72,5.5 73.5,7 73.5,15.5 74.75,16.75 v78.25,16.75 78.75,16.75 v90.25,16.75
+12V  (via drill 0.3, 0.6)
  Top 0.305: R13.2 40.25,108.25 v40.75,108.75 | R14.2 60.75,108.25 v61.25,108.75
  Top 0.406: U$5.2 50.35,124.4 C52.1 47.58,124.55 C38.+
  Top 0.61: IC9.9 57.57,92.32 v58,92.75 | C52.1 54.7,124.55 v55,124.25
  Top 0.813: R1.2 26.75,24
  Bottom 0.61: C20.1 90.25,81.75 | 21.75,108.75 21.75,108.5 19.25,106 19.25,91.75 16.75,89.25 BZ1.+ | v58,92.75 58,108 58.75,108.75 | v55,124.25 55,110.25 56.5,108.75
  Bottom 0.813: OPAMP1.P$10 71.2,110.3 71.5,110 | 89.5,85.25 C47.+ 90.25,85.25 | OPAMP1.P$11 v61.25,108.75 58.75,108.75 56.5,108.75 v40.75,108.75 21.75,108.75 19.46,111.04 CN5.P$3
  Bottom 2.54: v24.75,24.75 86.5,24.75 90.25,28.5 90.25,81.75 90.25,85.25 90.25,106.5 86.75,110 71.5,110 71.25,110 70,108.75 OPAMP1.P$11
  other vias: 22.75,28.25 22.75,26.5 22.75,24.75 20.75,24.75
  pour Top (isolate 0.254, no thermals): 18.5,24.5 18.5,29 27.25,29 27.25,23.75 22.5,23.75 22,23.25 22,19.75 19.75,19.75 19.75,22.25 18.5,23.5
  pour Bottom (isolate 0.254, no thermals): 18.5,29 27.25,29 27.25,23.75 18.5,23.75
A
  Top 0.406: IC5.6 64.86,38.97 R46.2 64.5,38.75 | 64.5,38.75 R12.1 | 64.5,38.75 64.5,34.08 CN3.P$3
A1
  Top 0.406: IC13.7 48.42,39.08 48.75,38.75 48.75,30.46 CN2.P$2
ANALOG_IN  (via drill 0.3)
  Top 0.254: U$2.P$26 51.28,66.03 v51.25,66 | CN6.P$1 24.86,70.79 R34.2
  Bottom 0.254: v51.25,66 50.75,65.5 23.79,65.5 CN6.P$1
B
  Top 0.406: IC5.7 66.14,38.97 R46.1 | R46.1 R16.2 | R46.1 66.35,30.85 CN3.P$2
B1
  Top 0.406: IC13.8 49.7,35.05 53.5,31.25 53.5,30.13 CN2.P$1
BUZZER
  Top 0.406: BZ1.- 53,89.25 53.67,89.92 IC9.10
BUZZER_MCU
  Top 0.254: U$2.P$56 50.78,82.03 53.67,84.92 IC9.7
CURRENT_MONITORING  (via drill 0.3)
  Top 0.254: U$2.P$8 37.5,73.75 36.75,74.5 v36.75,87.75 | R109.1 45.52,115 38.25,115 36.75,113.5 v36.75,93
  Top 0.305: R109.1 45.65,116.8 R108.2
  Bottom 0.254: v36.75,87.75 v36.75,93
CURRENT_SENSE
  Top 0.305: U$5.5 49.03,115.14 D5.C | D5.C 49.05,112.88 C64.2 | D5.C R109.2
D+_B
  Top 0.254: TVS1.4 80.86,13.39 79.61,13.39 74.5,18.5 74.5,35 77.75,38.25 U$12.4
  Top 0.406: TVS1.4 80.86,7.39 82.04,6.21 X6.3
D-_B  (via drill 0.3)
  Top 0.254: U$12.3 77.25,38.75 73.5,35 73.5,18 v79,12.5
  Top 0.406: TVS1.6 v82.76,11 X6.2
  Bottom 0.254: v79,12.5 81.26,12.5 v82.76,11
DAC
  Top 0.254: IC20.8 64.34,59.59 64.75,60 64.75,71.75 61.75,74.75 R29.1
EN_RS485  (via drill 0.3)
  Top 0.254: IC5.2 66.25,46.62 66.25,48.75 66.5,49 R17.1 66.5,49.1 v66.5,54.25 | U$2.P$44 58.75,75.25 v59.25,75.75
  Top 0.406: IC5.3 IC5.2
  Bottom 0.254: v66.5,54.25 66.5,69.75 60.5,75.75 v59.25,75.75
ES  (via drill 0.3)
  Top 0.406: 63.48,115.12 U$3.P$4 63.5,115.07 v63.5,112.75
  Bottom 0.406: OPAMP1.P$9 64.1,112.15 v63.5,112.75
ES_MCU
  Top 0.254: U$2.P$50 53.78,81.53 62.25,90 62.25,115.75 61.94,116.06 U$3.P$2
FAN
  Top 0.61: CN5.P$4 24.54,93.46 27.75,90.25 49.5,90.25 49.87,90.61 IC9.13
FAN_MCU
  Top 0.254: U$2.P$59 49.28,83.53 49.75,84 49.75,86.06 IC9.4
ILIM
  Top 0.406: OPAMP1.P$8 67.85,113.85 67,113 67,86.25 67.5,85.75 67.5,84.45 R26.2 67.41,83.95 IC1.1
LDAC
  Top 0.254: U$2.P$24 50.28,64.75 51.63,63.41 IC20.5
MCU_SUPPLY  (via drill 0.3)
  Top 0.254: C4.1 47.78,65.64 U$2.P$19 47.78,69.47 v47.5,69.75 | C3.1 C16.1 42.9,77.75 43.5,77.75 44,77.25 U$2.P$1 46.75,77.25 v47,77 | C9.1 U$2.P$32 54.28,68.97 v53.5,69.75 | U$2.P$13 40.1,71.25 C10.1 | C6.1 57.35,77.25 U$2.P$48 54.5,77.25 v54.25,77 | U$2.P$64 46.78,77.22
  Top 0.406: 46.78,77.22 v47,77
  Top 0.61: L7.1 v38,69 38,70.95 C15.1 38.3,71.35 C10.1
  Bottom 0.61: v38,69 38,69.25 38.5,69.75 46.25,69.75 | 46.25,69.75 v47.5,69.75 v53.5,69.75 54.25,70.5 v54.25,77 | v47,77 47,76.5 47,70.5 46.25,69.75
N$1
  Top 2.54: CN1.P$2 8.96,41.98 FUSE.IN
  Bottom 2.54: CN1.P$2 8.96,41.96 12,45
N$2
  Top 0.254: 51.35,42.75 C18.1
  Top 0.406: IC13.6 47.16,42.16 47.75,42.75 51.35,42.75
N$3
  Top 0.305: LED2.A R13.1
N$4
  Top 0.254: U$2.P$30 53.28,65.52 C13.1
N$5
  Top 0.305: LED3.A R14.1
N$6
  Top 0.305: R20.2 R21.1
  Top 0.406: R21.1 68.55,123.3 OPAMP1.P$3
N$7
  Top 0.305: IC1.2 66.14,83.92 R26.1 R27.2
N$8  (via drill 0.6)
  Top 2.54: FUSE.OUT 27.03,40.53 24.25,37.75
  Bottom 2.54: FUSE.OUT 27.03,40.6 U$15.2
  other vias: 19.5,37 21.25,37 24.75,33 24.75,34.75
  pour Top (isolate 0.254, no thermals): 18.5,33 18.5,37.5 19.5,38.5 25.75,38.5 26.75,37.5 26.75,33.5 26.75,33 25.75,32 19.5,32
  pour Bottom (isolate 0.254, no thermals): 18.5,37.5 19.5,38.5 25.75,38.5 26.75,37.5 26.75,33 25.75,32 19.5,32 18.5,33
N$9
  Top 0.305: R24.2 R25.1
  Top 0.406: OPAMP1.P$4 65.05,120.65 R25.1
N$10
  Top 0.305: R29.2 R28.2 61.95,80.05 62.25,79.75 64.5,79.75 64.86,80.11 IC1.3
N$11
  Top 0.61: CN4.P$2 77.96,21.24 R4.2
N$12
  Top 0.406: IC5.4 63.59,47.66 63.25,48 R5.2
N$13
  Top 0.406: IC6.2 18.52,123.86 R30.2 R31.1
N$14
  Top 0.305: R15.1 LED1.A
N$15
  Top 0.406: IC6.1 18.55,122.59 R30.1 R33.2
N$17
  Top 0.305: R86.2 59.5,141.25 arc-90 60,140.75 60,138 arc-90 59.59,137.59 59.43,137.59 arc90 59.03,137.19 59.03,137 arc90 59.43,136.59 59.59,136.59 arc-90 60,136.19 60,136 arc-90 59.59,135.6 59.43,135.6 arc90 59.03,135.19 59.03,135 arc90 59.43,134.6 59.59,134.6 arc-90 60,134.19 60,134.01 arc-90 59.59,133.6 59.43,133.6 arc90 59.03,133.19 59.03,133.01 arc90 59.43,132.6 59.59,132.6 arc-90 60,132.19 60,121.5 arc-90 59.25,120.75 R84.1
  Top 1.676: R86.2 57.5,141.25
  Top 2.54: 57.5,141.25 L3.2
N$25
  Top 0.254: U$12.16 C33.1
N$30
  Top 0.406: X6.1 L2.1
N$45
  Top 0.254: 39.5,37.9 C24.1
  Top 0.406: IC13.1 40.8,39.8 39.5,38.5 39.5,37.9
N$54
  Top 0.254: 42.5,38.1 C24.2
  Top 0.406: IC13.3 43.34,39.59 42.5,38.75 42.5,38.1
N$62
  Top 0.406: IC5.1 67.41,47.41 68.15,48.65 R102.1
N$65
  Top 0.254: 44.62,38.02 C12.1
  Top 0.406: IC13.4 44.62,38.02
N$66
  Top 0.406: IC13.5 45.88,39.02 C12.2
N$67
  Top 0.254: C17.1 38.6,42.35 39,42.75 | 42,40.75 IC13.2
  Top 0.406: 39,42.75 41.5,42.75 42,42.25 42,40.75
N$69
  Top 0.254: U$2.P$60 48.78,81.22 48.5,81.5 R54.2
N$87
  Top 0.305: R83.2 51.38,118.5 51,118.12 51,117.33 U$5.8
N$88
  Top 0.305: R84.2 51.38,120.75 51,121.12 51,121.67 U$5.1
N$216
  Top 1.016: IC2.2 17.85,18.7 U$13.P$1
  Top 1.778: U$13.P$1 17.12,17.87 14,14.75 13.53,14.75 L5.1
N$219
  Top 0.305: R68.2 20.5,10.45 R111.1 19.5,10.5 19,11 19,14.75 19.55,15.3 IC2.4
NRST  (via drill 0.3)
  Top 0.254: U$2.P$7 43.25,74.25 v42.75,74.75 | C11.1 72.6,78.65 v72.25,79
  Top 0.305: C11.1 72.6,74.95 R3.1 72.35,74.5 73.25,74.5 74.06,73.69 SV4.2
  Bottom 0.254: v42.75,74.75 42.75,78.75 43.75,79.75 71.5,79.75 v72.25,79
PT1000
  Top 0.406: CN5.P$2 14.38,130.28 C27.2 R32.2 14.25,128.15 14.25,125.5 14.62,125.14 IC6.3
PT1000_ADC
  Top 0.254: C28.1 18.65,75.1 21,72.75 U$2.P$10
  Top 0.406: C28.1 18.65,119.05 R33.1
RX_LED
  Top 0.305: IC9.12 51.13,94.11 50.5,94.75 41.25,94.75 40.25,95.75 LED2.C
RX_LED_MCU
  Top 0.254: U$2.P$58 49.78,83.28 51.13,84.64 IC9.5
SLIDE_SWITCH  (via drill 0.3)
  Top 0.254: CN7.P$1 24.86,59.04 R35.2 | U$2.P$36 57.75,71.25 v58.5,70.5
  Bottom 0.254: v58.5,70.5 58.5,64.5 58,64 23.46,64 CN7.P$1
SPI1_MOSI
  Top 0.254: IC20.4 66.16,63.41 65.25,62.5 65.25,59 64.5,58.25 50.5,58.25 49.78,58.97 U$2.P$23
SPI1_NSS
  Top 0.254: IC20.2 66.61,60.87 66.25,60.5 66.25,58 65.5,57.25 50,57.25 48.75,58.5 48.75,66 48.28,66.47 U$2.P$20
SPI1_SCK
  Top 0.254: IC20.3 66.39,62.13 65.75,61.5 65.75,58.5 65,57.75 50.25,57.75 49.25,58.75 49.25,66.25 48.78,66.72 U$2.P$21
SUPPLY
  Top 0.61: 38.2,21.75 R2.1
  Top 0.813: 38.2,21.75 R1.1 38.2,29.93 CN2.P$4
SWCLK  (via drill 0.3)
  Top 0.254: U$2.P$49 54.28,80.78 v54.75,81.25
  Bottom 0.254: v54.75,81.25 74.94,81.25 SV4.5
SWDIO  (via drill 0.3)
  Top 0.254: U$2.P$46 58,76.25 v58.25,76.5
  Bottom 0.254: v58.25,76.5 58.5,76.75 74.48,76.75 SV4.3
SWO  (via drill 0.3)
  Top 0.254: U$2.P$55 51.28,81.28 v52.25,82.25
  Bottom 0.254: v52.25,82.25 52.56,82.56 76.69,82.56 77.5,81.75 77.5,72.25 76.5,71.25 75.1,71.25 SV4.1
THERMAL_PAD  (via drill 0.6)
  other vias: 97.25,147 97.25,143 97.25,139 97.25,135 97.25,131 97.25,127 97.25,123 97.25,119 97.25,115 97.25,111 97.25,107 97.25,103 97.25,99 97.25,95 97.25,91 97.25,87 97.25,83 97.25,79 97.25,75 97.25,71 97.25,67 97.25,63 97.25,59 97.25,55 97.25,51 97.25,47 97.25,43 97.25,39 97.25,35 97.25,31 97.25,27 97.25,23 97.25,19 97.25,15 97.25,11 97.25,7 97.25,3
  pour Top (isolate 0.254, no thermals): 95.25,149.5 100.5,149.5 100.5,0 95.5,0 95.25,0
  pour Bottom: 95.25,0 100.5,0 100.5,149.5 95.25,149.5
THERMAL_PAD1  (via drill 0.6)
  other vias: 2.75,147 2.75,143 2.75,139 2.75,135 2.75,131 2.75,127 2.75,123 2.75,119 2.75,115 2.75,111 2.75,107 2.75,103 2.75,99 2.75,95 2.75,91 2.75,87 2.75,83 2.75,79 2.75,75 2.75,71 2.75,67 2.75,63 2.75,59 2.75,55 2.75,51 2.75,47 2.75,43 2.75,39 2.75,35 2.75,31 2.75,27 2.75,23 2.75,19 2.75,15 2.75,11 2.75,7 2.75,3
  pour Top (isolate 0.254, no thermals): 0,0 5,0 5,149.9 0,149.9
  pour Bottom (isolate 0.254, no thermals): 5,0 0,0 0,149.9 5,149.9
TX_LED
  Top 0.305: IC9.11 52.41,94.16 53,94.75 60,94.75 60.75,95.5 LED3.C
TX_LED_MCU
  Top 0.254: U$2.P$57 50.28,82.53 52.41,84.66 IC9.6
UART4_RX
  Top 0.254: U$2.P$15 44,70.25 42.75,69 42.75,61.25 SV1.2
UART4_TX
  Top 0.254: U$2.P$14 43.5,70.75 41,68.25 SV1.3
USART1_RX  (via drill 0.3)
  Top 0.254: R102.2 68.25,52 v67.75,52.5 | v60,74.75 U$2.P$43
  Bottom 0.254: v67.75,52.5 65.25,52.5 64.75,53 64.75,70 v60,74.75
USART1_TX  (via drill 0.3)
  Top 0.254: U$2.P$42 58.75,74.25 v59,74 | v63.25,52 R5.1
  Bottom 0.254: v63.25,52 63.25,70.25 59.5,74 v59,74
USART2_RX
  Top 0.254: U$2.P$17 46.78,66.78 44.75,64.75 44.75,53.75 49.7,48.8 IC13.9
USART2_TX
  Top 0.254: U$2.P$16 44.5,69.75 44.25,69.5 44.25,53.5 48.42,49.33 IC13.10
USART6_RX  (via drill 0.3)
  Top 0.254: U$2.P$38 59.75,72.25 v60.25,71.75 | v70.5,46.25 72.45,44.3 U$12.21
  Bottom 0.254: v70.5,46.25 64,46.25 62,48.25 62,70 v60.25,71.75
USART6_TX  (via drill 0.3)
  Top 0.254: U$2.P$37 58.75,71.75 v59.25,71.25 | U$12.20 73.45,44.8 v73,45.25
  Bottom 0.254: v73,45.25 64,45.25 61.25,48 61.25,69.25 v59.25,71.25
VBUS
  Top 0.254: U$12.8 R18.2
  Top 0.305: R18.2 84,43.3 R19.1
VCC_B
  Top 0.305: TVS1.5 81.75,13.35 81.75,14.25 82,14.5 84.95,14.5 L2.2 | R19.2 87.5,43.25 88,42.75 88,15.5 87,14.5 85.55,14.5 L2.2 | 85.3,14.25 L2.2
VOLTAGE_MONITORING  (via drill 0.3)
  Top 0.254: R22.1 34.75,129.35 R23.2 v34.85,93.15 | U$2.P$9 36.25,73.25 34.85,74.65 v34.85,87.65
  Bottom 0.254: v34.85,93.15 v34.85,87.65
VOUT
  Top 0.305: R86.1 62,141.25 arc90 61.5,140.75 61.5,119.25 arc-90 60.75,118.5 R83.1
  Top 0.406: OPAMP1.P$1 69.25,125.75 68.75,125.25 | R21.2 65.05,125.25 65.05,125.55 67.38,127.88
  Top 1.676: 64.5,141 64.25,141 63.8,141 R86.1
  Top 1.778: OPAMP1.P$2 OPAMP1.P$1
  Top 2.54: OPAMP1.P$1 67.38,127.88 64.5,130.75 64.5,140.75 64.25,141
VOUT_CONT
  Top 0.254: CN5.P$6 34.7,132.65 R22.2
  Bottom 1.778: CN5.P$6 34.7,136.75 D1.C
  pour Top (isolate 0.254, no thermals): 43.75,144 33,144 33,138.5 43.75,138.5

### Text on the board
tPlace: V1.0 | POWER | RS-232 | RS-485 | LED
tDocu: AL-115-15